# Altium project vme6U_carrier_Cyc_V_SoC.PrjPcb (part 1 of 8)
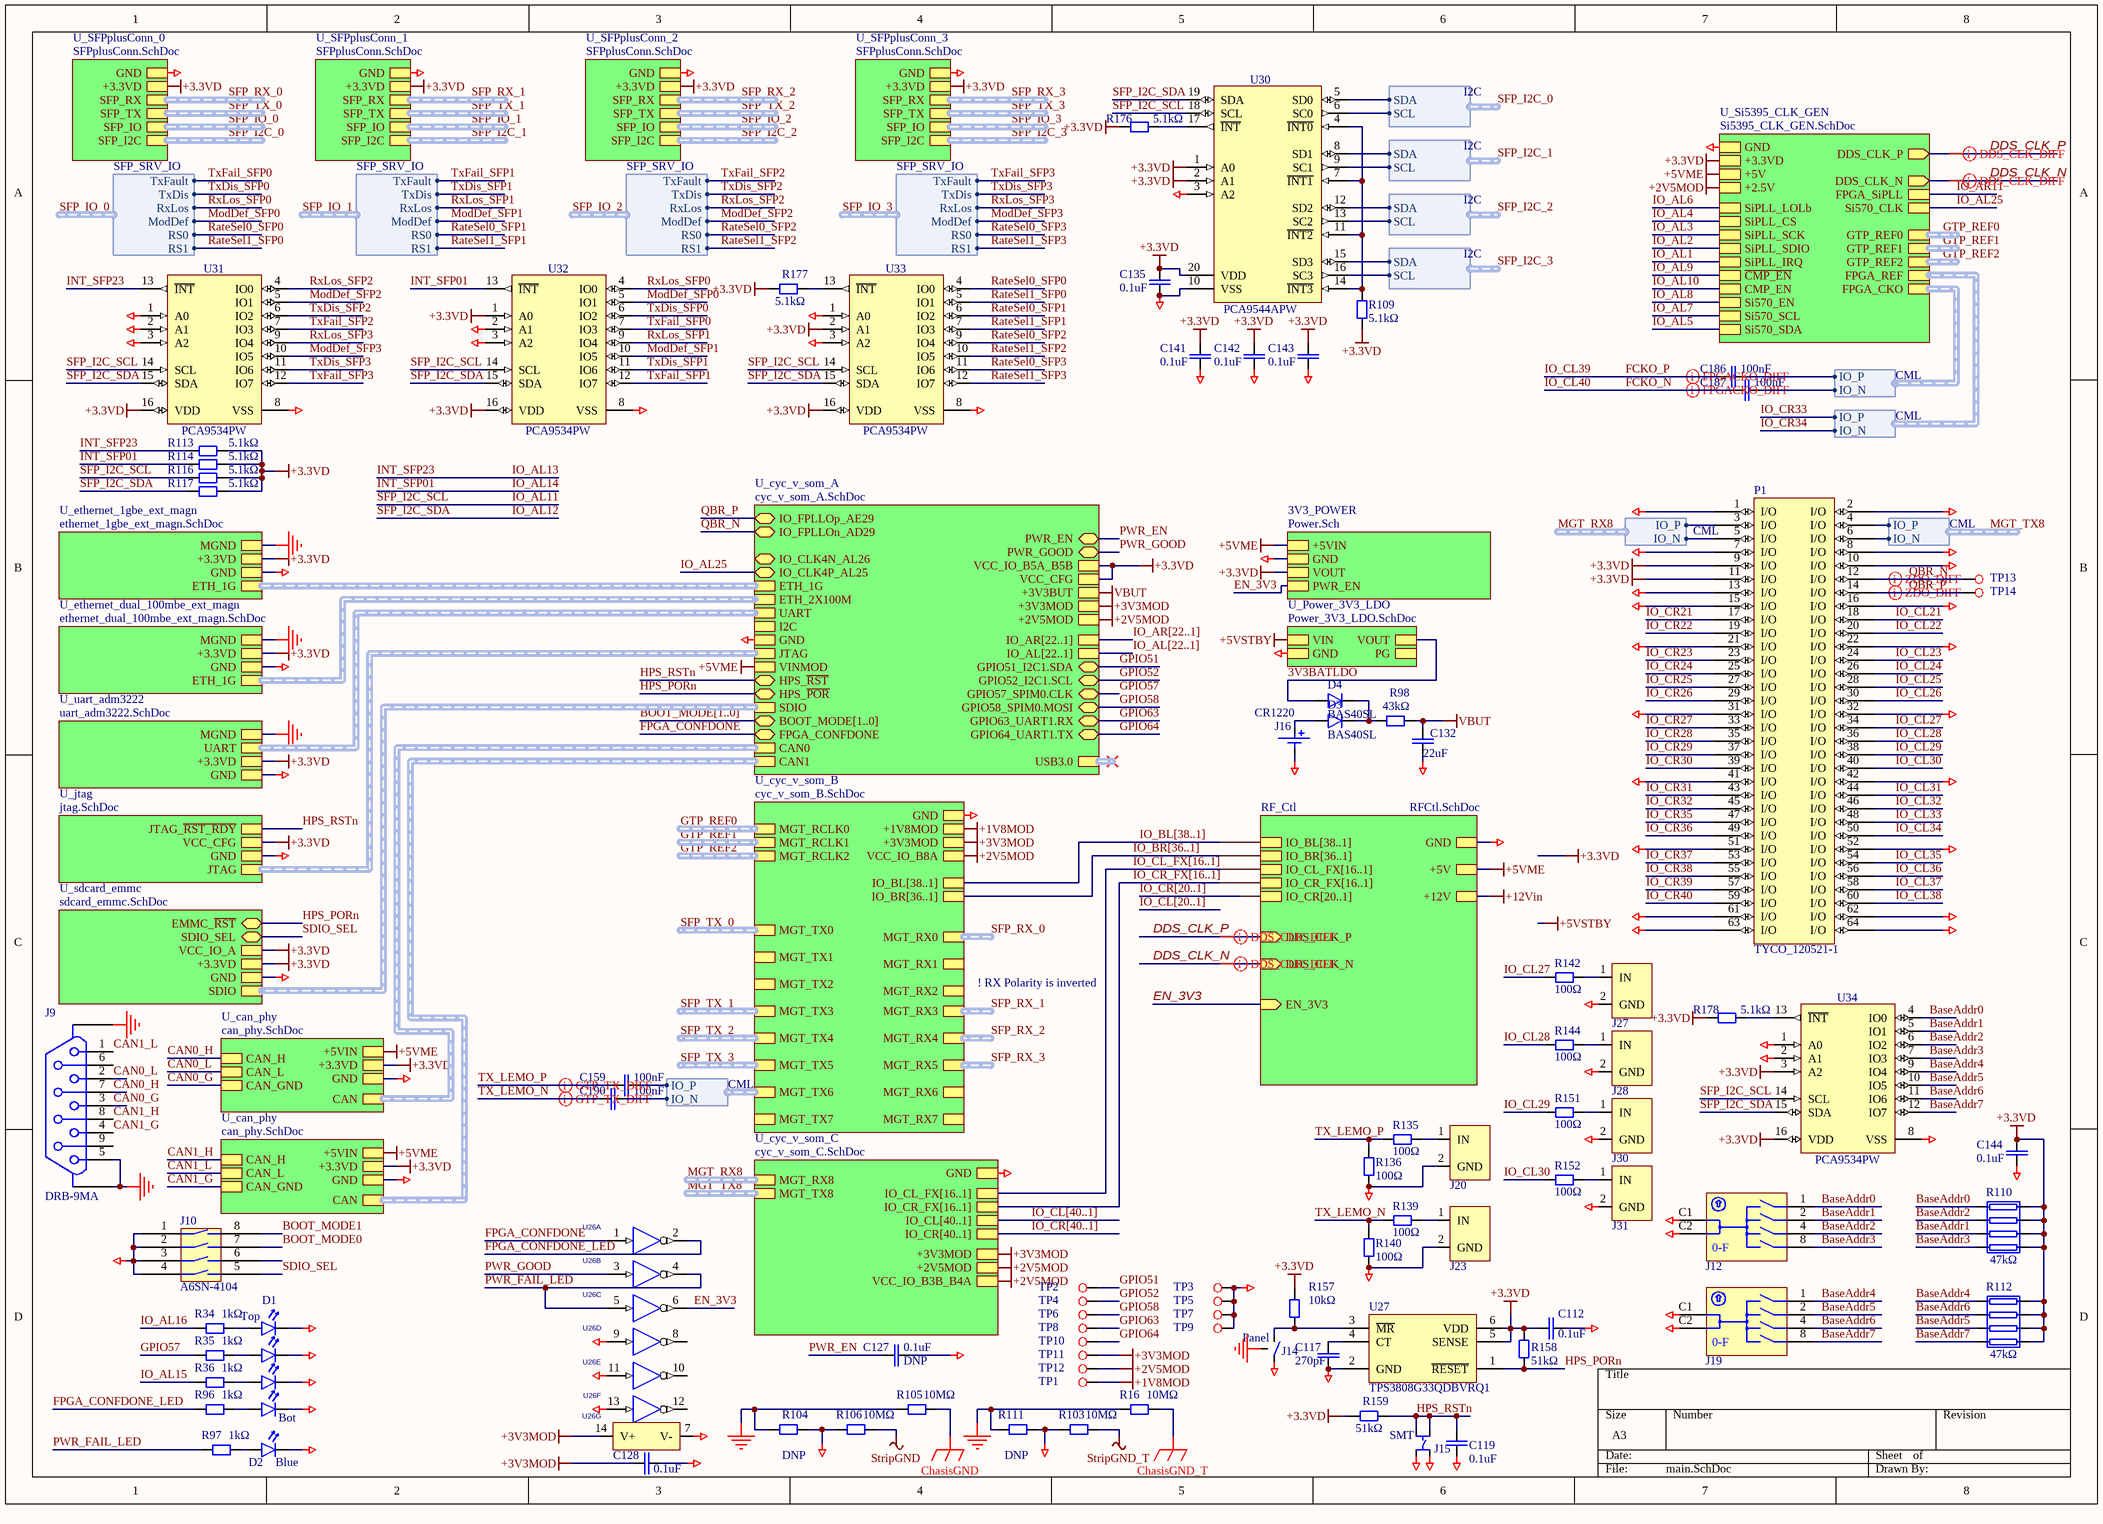
[diagram p0: main.SchDoc]
28 sheets, 1310 parts. Net scope: strictly hierarchical (ports join the sheet entries above them; power ports are local).
Board file: SupBigBrrg_0.PcbDoc
Sheets:
  main.SchDoc
    U_cyc_v_som_A = cyc_v_som_A.SchDoc
    U_cyc_v_som_B = cyc_v_som_B.SchDoc
    U_cyc_v_som_C = cyc_v_som_C.SchDoc
    U_ethernet_1gbe_ext_magn = ethernet_1gbe_ext_magn.SchDoc
    U_ethernet_dual_100mbe_ext_magn = ethernet_dual_100mbe_ext_magn.SchDoc
    U_uart_adm3222 = uart_adm3222.SchDoc
    U_jtag = jtag.SchDoc
    U_sdcard_emmc = sdcard_emmc.SchDoc
    U_can_phy = can_phy.SchDoc
    U_can_phy = can_phy.SchDoc
    U_Power_3V3_LDO = Power_3V3_LDO.SchDoc
    U_SFPplusConn_0 = SFPplusConn.SchDoc
    U_SFPplusConn_1 = SFPplusConn.SchDoc
    U_SFPplusConn_2 = SFPplusConn.SchDoc
    U_SFPplusConn_3 = SFPplusConn.SchDoc
    U_Si5395_CLK_GEN = Si5395_CLK_GEN.SchDoc
      U_power_REG104GA_1V8 = power_REG104GA_1V8.SchDoc
      U_power_REG104GA_3V3 = power_REG104GA_3V3.SchDoc
    RF_Ctl = RFCtl.SchDoc
      RF_H = Hall.SchDoc
        H_DCDC = DCDC_Hall.SchDoc
          DCP_H- = DCP.SchDoc
      RF_i = Integrator.SchDoc
        i_DCDC = DCDC_int.SchDoc
          DCP_i- = DCP.SchDoc
          DCP_i+ = DCP.SchDoc
      RF_D = DDS.SchDoc
        D_DCDC = DCDC_DDS.SchDoc
          DCP_D+ = DCP.SchDoc
          DCP_D- = DCP.SchDoc
      RF_S = SlowChans.SchDoc
        S_DCDC = DCDC_Slow.SchDoc
          DCP_S+ = DCP.SchDoc
          DCP_S- = DCP.SchDoc
  DiagrammaStrutturale.SchDoc
  PowerSys.DiagrammaStrutturaleH.SchDoc
  Buffers.DiagrammaStrutturale.SchDoc

## Sheet main.SchDoc
size A3

### Parts
(Parts that share a designator on the sheet are numbered #1, #2 ... from top to bottom, then left to right.)
C112#1  0.1uF  [CAPC2012N]
C117#1  270pF  [CAPC2012N]
C119  0.1uF  [CAPC2012N]
C127#1  PartField: 0.1uF  [CAPC2012N]  (hidden comment: DNP)
C128  0.1uF  [CAPC2012N]
C132  22uF  [CAPC2012N]
C135  0.1uF  [CAPC2012N]
C141  0.1uF  [CAPC2012N]
C142#1  0.1uF  [CAPC2012N]
C143#1  0.1uF  [CAPC2012N]
C144  0.1uF  [CAPC2012N]
C159#1  100nF  [CAPC1608N]
C186  100nF  [CAPC1608N]
C187  100nF  [CAPC1608N]
C190  100nF  [CAPC1608N]
D1  H485CGDL  [LED_H485C]  (value not drawn)
D2  Color: Blue  [LEDC1608N]  (hidden comment: LB Q39E-N1OO-35-1)
D3  BAS40SL  [SOD_923]
D4  BAS40SL  [SOD_923]
J9  DRB-9MA  [DRB-9MA]
J10  A6SN-4104  [DIPSW4-A6SN8]
J12  ERD116XSZ  [SW_ECE_ERD116XSZ]  (value not drawn)
J14  PTS645VL582LFS  [PTS645VL582LFS]  (value not drawn)
J15  PTS645SL43SMTR92  [PTS645SL43SMTR92]  (value not drawn)
J16  BC501SM  [BAT_CR1220]  (value not drawn)
J19  ERD116XSZ  [SW_ECE_ERD116XSZ]  (value not drawn)
J20  DNP  [LEMO_EPA.00.250.NTN]  (value not drawn)
J23  DNP  [LEMO_EPA.00.250.NTN]  (value not drawn)
J27  DNP  [LEMO_EPA.00.250.NTN]  (value not drawn)
J28  DNP  [LEMO_EPA.00.250.NTN]  (value not drawn)
J30  DNP  [LEMO_EPA.00.250.NTN]  (value not drawn)
J31  DNP  [LEMO_EPA.00.250.NTN]  (value not drawn)
P1  TYCO_120521-1  [TYCO_120521-1]
R16  10MΩ  [RESC2012N]
R34  1kΩ  [RESC2012N]
R35  1kΩ  [RESC2012N]
R36  1kΩ  [RESC2012N]
R96  1kΩ  [RESC2012N]
R97#1  1kΩ  [RESC2012N]
R98#1  43kΩ  [RESC2012N]
R103#1  10MΩ  [RESC2012N]
R104#1  DNP  [RESC2012N]
R105  10MΩ  [RESC2012N]
R106#1  10MΩ  [RESC2012N]
R109  5.1kΩ  [RESC2012N]
R110#1  value 47kΩ  [CAY16-J4]  (hidden comment: CAY16-4702F4LF)
R111#1  DNP  [RESC2012N]
R112  value 47kΩ  [CAY16-J4]  (hidden comment: CAY16-4702F4LF)
R113#1  5.1kΩ  [RESC2012N]
R114#1  5.1kΩ  [RESC2012N]
R116  5.1kΩ  [RESC2012N]
R117#1  5.1kΩ  [RESC2012N]
R135#1  100Ω  [RESC1608N]
R136  100Ω  [RESC1608N]
R139  100Ω  [RESC1608N]
R140  100Ω  [RESC1608N]
R142  100Ω  [RESC1608N]
R144  100Ω  [RESC1608N]
R151  100Ω  [RESC1608N]
R152  100Ω  [RESC1608N]
R157  10kΩ  [RESC2012N]
R158  51kΩ  [RESC2012N]
R159  51kΩ  [RESC2012N]
R176  5.1kΩ  [RESC2012N]
R177  5.1kΩ  [RESC2012N]
R178  5.1kΩ  [RESC2012N]
TP1  test point  [TEST_POINT]  (value not drawn)  (no BOM)
TP2  test point  [TEST_POINT]  (value not drawn)  (no BOM)
TP3  test point  [TEST_POINT]  (value not drawn)  (no BOM)
TP4  test point  [TEST_POINT]  (value not drawn)  (no BOM)
TP5  test point  [TEST_POINT]  (value not drawn)  (no BOM)
TP6  test point  [TEST_POINT]  (value not drawn)  (no BOM)
TP7  test point  [TEST_POINT]  (value not drawn)  (no BOM)
TP8  test point  [TEST_POINT]  (value not drawn)  (no BOM)
TP9  test point  [TEST_POINT]  (value not drawn)  (no BOM)
TP10  test point  [TEST_POINT]  (value not drawn)  (no BOM)
TP11  test point  [TEST_POINT]  (value not drawn)  (no BOM)
TP12  test point  [TEST_POINT]  (value not drawn)  (no BOM)
TP13  test point  [TEST_POINT]  (value not drawn)  (no BOM)
TP14  test point  [TEST_POINT]  (value not drawn)  (no BOM)
U26#1  SN74LVC04APW  [SOP65P640X110-14N]  (value not drawn)  (parts A,B,C,D,E,F,G of 7)
U27  TPS3808G33QDBVRQ1  [SOT95P280X100-6N]
U30#1  PCA9544APW  [SOP65P640X110-20N]
U31#1  PCA9534PW  [SOP65P640X110-16N]
U32  PCA9534PW  [SOP65P640X110-16N]
U33  PCA9534PW  [SOP65P640X110-16N]
U34  PCA9534PW  [SOP65P640X110-16N]

### Sub-sheets
3V3_POWER = Power.Sch (file not in this document): +5VIN, GND, VOUT, PWR_EN
RF_Ctl = RFCtl.SchDoc: IO_CR[20..1], IO_BL[38..1], IO_BR[36..1], IO_CL_FX[16..1], IO_CR_FX[16..1], DDS_CLK_P (in), DDS_CLK_N (in), EN_3V3 (in), GND, +5V, +12V
U_can_phy = can_phy.SchDoc: CAN (harness CAN), GND, +3.3VD, CAN_H, CAN_L, CAN_GND, +5VIN
U_can_phy = can_phy.SchDoc: CAN (harness CAN), GND, +3.3VD, CAN_H, CAN_L, CAN_GND, +5VIN
U_cyc_v_som_A = cyc_v_som_A.SchDoc: ETH_1G (harness EthLanes), ETH_2X100M (harness EthLanes), UART (harness UART), I2C (harness I2C), GND, JTAG (harness JTAG), VINMOD, HPS_~{RST} (bidir), HPS_~{POR} (bidir), SDIO (harness SDIO), BOOT_MODE[1..0] (bidir), FPGA_CONFDONE (bidir), CAN0 (harness CAN), CAN1 (harness CAN), IO_AR[22..1], +2V5MOD, +3V3MOD, GPIO52_I2C1.SCL (bidir), GPIO63_UART1.RX (bidir), GPIO51_I2C1.SDA (bidir), GPIO57_SPIM0.CLK (bidir), GPIO64_UART1.TX (bidir), USB3.0 (harness USB3), GPIO58_SPIM0.MOSI (bidir), +3V3BUT, IO_CLK4N_AL26 (bidir), IO_CLK4P_AL25 (bidir), PWR_EN (bidir), PWR_GOOD (bidir), VCC_IO_B5A_B5B, VCC_CFG, IO_FPLLOp_AE29 (bidir), IO_AL[22..1], IO_FPLLOn_AD29 (bidir)
U_cyc_v_som_B = cyc_v_som_B.SchDoc: GND, MGT_RCLK2 (harness CML), MGT_RCLK1 (harness CML), IO_BL[38..1], IO_BR[36..1], MGT_RCLK0 (harness CML), +1V8MOD, +3V3MOD, VCC_IO_B8A, MGT_TX5 (harness CML), MGT_TX3 (harness CML), MGT_TX6 (harness CML), MGT_TX7 (harness CML), MGT_TX2 (harness CML), MGT_TX1 (harness CML), MGT_TX4 (harness CML), MGT_TX0 (harness CML), MGT_RX0 (harness CML), MGT_RX1 (harness CML), MGT_RX6 (harness CML), MGT_RX4 (harness CML), MGT_RX5 (harness CML), MGT_RX3 (harness CML), MGT_RX2 (harness CML), MGT_RX7 (harness CML)
U_cyc_v_som_C = cyc_v_som_C.SchDoc: GND, MGT_TX8 (harness CML), IO_CL_FX[16..1], IO_CR_FX[16..1], MGT_RX8 (harness CML), IO_CL[40..1], IO_CR[40..1], +3V3MOD, +2V5MOD, VCC_IO_B3B_B4A
U_ethernet_1gbe_ext_magn = ethernet_1gbe_ext_magn.SchDoc: ETH_1G (harness EthLanes), GND, +3.3VD, MGND
U_ethernet_dual_100mbe_ext_magn = ethernet_dual_100mbe_ext_magn.SchDoc: ETH_1G (harness EthLanes), GND, +3.3VD, MGND
U_jtag = jtag.SchDoc: JTAG (harness JTAG), GND, VCC_CFG, JTAG_~{RST_RDY}
U_Power_3V3_LDO = Power_3V3_LDO.SchDoc: GND, VOUT, VIN, PG
U_sdcard_emmc = sdcard_emmc.SchDoc: SDIO (harness SDIO), GND, +3.3VD, VCC_IO_A, SDIO_SEL (bidir), EMMC_~{RST} (bidir)
U_SFPplusConn_0 = SFPplusConn.SchDoc: GND, +3.3VD, SFP_TX (harness CML), SFP_RX (harness CML), SFP_IO (harness SFP_SRV_IO), SFP_I2C (harness I2C)
U_SFPplusConn_1 = SFPplusConn.SchDoc: GND, +3.3VD, SFP_TX (harness CML), SFP_RX (harness CML), SFP_IO (harness SFP_SRV_IO), SFP_I2C (harness I2C)
U_SFPplusConn_2 = SFPplusConn.SchDoc: GND, +3.3VD, SFP_TX (harness CML), SFP_RX (harness CML), SFP_IO (harness SFP_SRV_IO), SFP_I2C (harness I2C)
U_SFPplusConn_3 = SFPplusConn.SchDoc: GND, +3.3VD, SFP_TX (harness CML), SFP_RX (harness CML), SFP_IO (harness SFP_SRV_IO), SFP_I2C (harness I2C)
U_Si5395_CLK_GEN = Si5395_CLK_GEN.SchDoc: GND, +3.3VD, +5V, Si570_CLK, Si570_SCL, Si570_SDA, Si570_EN, ~{CMP_EN}, CMP_EN, +2.5V, FPGA_SiPLL, GTP_REF1 (harness CML), GTP_REF0 (harness CML), GTP_REF2 (harness CML), FPGA_CKO (harness CML), SiPLL_IRQ, SiPLL_SDIO, SiPLL_SCK, SiPLL_CS, FPGA_REF (harness CML), SiPLL_LOLb, DDS_CLK_P (out), DDS_CLK_N (out)
U_uart_adm3222 = uart_adm3222.SchDoc: GND, +3.3VD, UART (harness UART), MGND

### Harnesses
I2C: SDA, SCL
SFP_SRV_IO: TxDis, TxFault, RS0, RS1, ModDef, RxLos
CML: IO_N, IO_P

### Nets
+1V8MOD: TP1.1 ; sheet U_cyc_v_som_B/+1V8MOD
+2V5MOD: TP12.1 ; sheet U_cyc_v_som_A/+2V5MOD, sheet U_cyc_v_som_B/VCC_IO_B8A, sheet U_cyc_v_som_C/+2V5MOD, sheet U_cyc_v_som_C/VCC_IO_B3B_B4A, sheet U_Si5395_CLK_GEN/+2.5V
+3.3VD: C112#1.2 C135.1 C141.1 C142#1.1 C143#1.1 C144.1 P1.9(I/O) P1.11(I/O) R109.2 R110#1.5 R110#1.6 R110#1.7 R110#1.8 R112.5 R112.6 R112.7 R112.8 R113#1.2 R114#1.2 R116.2 R117#1.2 R157.1 R158.1 R159.1 R176.1 R177.1 R178.1 U27.5(SENSE) U27.6(VDD) U30#1.1(A0) U30#1.2(A1) U30#1.20(VDD) U31#1.16(VDD) U32.1(A0) U32.16(VDD) U33.2(A1) U33.16(VDD) U34.3(A2) U34.16(VDD) ; sheet U_cyc_v_som_A/VCC_IO_B5A_B5B, sheet U_cyc_v_som_A/VCC_CFG, sheet U_ethernet_1gbe_ext_magn/+3.3VD, sheet U_ethernet_dual_100mbe_ext_magn/+3.3VD, sheet U_uart_adm3222/+3.3VD, sheet U_jtag/VCC_CFG, sheet U_sdcard_emmc/+3.3VD, sheet U_sdcard_emmc/VCC_IO_A, sheet 3V3_POWER/VOUT, sheet U_can_phy/+3.3VD, sheet U_can_phy/+3.3VD, sheet U_SFPplusConn_0/+3.3VD, sheet U_SFPplusConn_1/+3.3VD, sheet U_SFPplusConn_2/+3.3VD, sheet U_SFPplusConn_3/+3.3VD, sheet U_Si5395_CLK_GEN/+3.3VD
+3V3MOD: C128.2 TP11.1 U26#1.14(V+) ; sheet U_cyc_v_som_A/+3V3MOD, sheet U_cyc_v_som_B/+3V3MOD, sheet U_cyc_v_som_C/+3V3MOD
+5VME: sheet U_cyc_v_som_A/VINMOD, sheet 3V3_POWER/+5VIN, sheet U_can_phy/+5VIN, sheet U_can_phy/+5VIN, sheet U_Si5395_CLK_GEN/+5V, sheet RF_Ctl/+5V
ChasisGND: R105.2
ChasisGND_T: R16.2
GND: C112#1.1 C117#1.2 C119.2 C127#1.1 C128.1 C132.1 C135.2 C141.2 C142#1.2 C143#1.2 C144.2 D1.2(C) D1.4(C) D1.6(C) D1.8(C) D2.1(C) J10.1 J10.2 J10.3 J10.4 J12.C1(C) J12.C2(C) J14.2 J15.3 J15.4 J16.2(-) J19.C1(C) J19.C2(C) J20.2(GND) J23.2(GND) J27.2(GND) J28.2(GND) J30.2(GND) J31.2(GND) P1.1(I/O) P1.2(I/O) P1.7(I/O) P1.8(I/O) P1.10(I/O) P1.13(I/O) P1.15(I/O) P1.16(I/O) P1.21(I/O) P1.22(I/O) P1.31(I/O) P1.32(I/O) P1.41(I/O) P1.42(I/O) P1.51(I/O) P1.52(I/O) P1.61(I/O) P1.62(I/O) P1.63(I/O) P1.64(I/O) R103#1.1 R104#1.2 R106#1.1 R111#1.2 R136.2 R140.2 TP3.1 TP5.1 TP7.1 TP9.1 U26#1.7(V-) U26#1.9(A) U26#1.11(A) U26#1.13(A) U27.2(GND) U30#1.3(A2) U30#1.10(VSS) U31#1.1(A0) U31#1.2(A1) U31#1.3(A2) U31#1.8(VSS) U32.2(A1) U32.3(A2) U32.8(VSS) U33.1(A0) U33.3(A2) U33.8(VSS) U34.1(A0) U34.2(A1) U34.8(VSS) ; sheet U_cyc_v_som_A/GND, sheet U_cyc_v_som_B/GND, sheet U_cyc_v_som_C/GND, sheet U_ethernet_1gbe_ext_magn/GND, sheet U_ethernet_dual_100mbe_ext_magn/GND, sheet U_uart_adm3222/GND, sheet U_jtag/GND, sheet U_sdcard_emmc/GND, sheet 3V3_POWER/GND, sheet U_can_phy/GND, sheet U_can_phy/GND, sheet U_Power_3V3_LDO/GND, sheet U_SFPplusConn_0/GND, sheet U_SFPplusConn_1/GND, sheet U_SFPplusConn_2/GND, sheet U_SFPplusConn_3/GND, sheet U_Si5395_CLK_GEN/GND, sheet RF_Ctl/GND  [project net POK_int]
MGND: J9.5 J9.S1(SHLD) J9.S2(SHLD) J14.0(S) R16.1 R104#1.1 R105.1 R111#1.1 ; sheet U_ethernet_1gbe_ext_magn/MGND, sheet U_ethernet_dual_100mbe_ext_magn/MGND, sheet U_uart_adm3222/MGND
StripGND: R106#1.2
StripGND_T: R103#1.2
VBUT: C132.2 R98#1.1 ; sheet U_cyc_v_som_A/+3V3BUT
3V3BATLDO: D4.1(A) ; sheet U_Power_3V3_LDO/VOUT
BaseAddr0: J12.1 R110#1.4 U34.4(IO0)
BaseAddr1: J12.2 R110#1.2 U34.5(IO1)
BaseAddr2: J12.4 R110#1.3 U34.6(IO2)
BaseAddr3: J12.8 R110#1.1 U34.7(IO3)
BaseAddr4: J19.1 R112.4 U34.9(IO4)
BaseAddr5: J19.2 R112.2 U34.10(IO5)
BaseAddr6: J19.4 R112.3 U34.11(IO6)
BaseAddr7: J19.8 R112.1 U34.12(IO7)
BOOT_MODE0: J10.7
BOOT_MODE1: J10.8
CAN0_G: J9.3 ; sheet U_can_phy/CAN_GND
CAN0_H: J9.7 ; sheet U_can_phy/CAN_H
CAN0_L: J9.2 ; sheet U_can_phy/CAN_L
CAN1_G: J9.4 ; sheet U_can_phy/CAN_GND
CAN1_H: J9.8 ; sheet U_can_phy/CAN_H
CAN1_L: J9.1 ; sheet U_can_phy/CAN_L
DDS_CLK_N: sheet U_Si5395_CLK_GEN/DDS_CLK_N, sheet RF_Ctl/DDS_CLK_N
DDS_CLK_P: sheet U_Si5395_CLK_GEN/DDS_CLK_P, sheet RF_Ctl/DDS_CLK_P
EN_3V3: U26#1.6(B) ; sheet 3V3_POWER/PWR_EN, sheet RF_Ctl/EN_3V3
FCKO_N: C187.1  [also labelled IO_CL40]
FCKO_P: C186.1  [also labelled IO_CL39]
FPGA_CONFDONE: U26#1.1(A) ; sheet U_cyc_v_som_A/FPGA_CONFDONE
FPGA_CONFDONE_LED: R96.1 U26#1.2(B)
GPIO51: TP2.1 ; sheet U_cyc_v_som_A/GPIO51_I2C1.SDA
GPIO52: TP4.1 ; sheet U_cyc_v_som_A/GPIO52_I2C1.SCL
GPIO57: R35.1 ; sheet U_cyc_v_som_A/GPIO57_SPIM0.CLK
GPIO58: TP6.1 ; sheet U_cyc_v_som_A/GPIO58_SPIM0.MOSI
GPIO63: TP8.1 ; sheet U_cyc_v_som_A/GPIO63_UART1.RX
GPIO64: TP10.1 ; sheet U_cyc_v_som_A/GPIO64_UART1.TX
HPS_PORn: R158.2 U27.1(~{RESET}) ; sheet U_cyc_v_som_A/HPS_~{POR}, sheet U_sdcard_emmc/EMMC_~{RST}
HPS_RSTn: C119.1 J15.1 J15.2 R159.2 ; sheet U_cyc_v_som_A/HPS_~{RST}, sheet U_jtag/JTAG_~{RST_RDY}
IN2_N: C187.2 ; sheet U_Si5395_CLK_GEN/FPGA_CKO.IO_N
IN2_P: C186.2 ; sheet U_Si5395_CLK_GEN/FPGA_CKO.IO_P
INT_SFP01: R114#1.1 U32.13(~{INT})  [also labelled IO_AL14]
INT_SFP23: R113#1.1 U31#1.13(~{INT})  [also labelled IO_AL13]
IO_AL11: R116.1 U30#1.18(SCL) U31#1.14(SCL) U32.14(SCL) U33.14(SCL) U34.14(SCL)  [also labelled SFP_I2C_SCL]
IO_AL12: R117#1.1 U30#1.19(SDA) U31#1.15(SDA) U32.15(SDA) U33.15(SDA) U34.15(SDA)  [also labelled SFP_I2C_SDA]
IO_AL15: R36.1
IO_AL16: R34.1
IO_AL25: sheet U_cyc_v_som_A/IO_CLK4P_AL25, sheet U_Si5395_CLK_GEN/Si570_CLK
IO_CL21: P1.18(I/O)
IO_CL22: P1.20(I/O)
IO_CL23: P1.24(I/O)
IO_CL24: P1.26(I/O)
IO_CL25: P1.28(I/O)
IO_CL26: P1.30(I/O)
IO_CL27: P1.34(I/O) R142.2
IO_CL28: P1.36(I/O) R144.2
IO_CL29: P1.38(I/O) R151.2
IO_CL30: P1.40(I/O) R152.2
IO_CL31: P1.44(I/O)
IO_CL32: P1.46(I/O)
IO_CL33: P1.48(I/O)
IO_CL34: P1.50(I/O)
IO_CL35: P1.54(I/O)
IO_CL36: P1.56(I/O)
IO_CL37: P1.58(I/O)
IO_CL38: P1.60(I/O)
IO_CR21: P1.17(I/O)
IO_CR22: P1.19(I/O)
IO_CR23: P1.23(I/O)
IO_CR24: P1.25(I/O)
IO_CR25: P1.27(I/O)
IO_CR26: P1.29(I/O)
IO_CR27: P1.33(I/O)
IO_CR28: P1.35(I/O)
IO_CR29: P1.37(I/O)
IO_CR30: P1.39(I/O)
IO_CR31: P1.43(I/O)
IO_CR32: P1.45(I/O)
IO_CR35: P1.47(I/O)
IO_CR36: P1.49(I/O)
IO_CR37: P1.53(I/O)
IO_CR38: P1.55(I/O)
IO_CR39: P1.57(I/O)
IO_CR40: P1.59(I/O)
MGT_RX8.IO_N: P1.5(I/O) ; sheet U_cyc_v_som_C/MGT_RX8.IO_N
MGT_RX8.IO_P: P1.3(I/O) ; sheet U_cyc_v_som_C/MGT_RX8.IO_P
MGT_TX6_N: C190.2 ; sheet U_cyc_v_som_B/MGT_TX6.IO_N
MGT_TX6_P: C159#1.2 ; sheet U_cyc_v_som_B/MGT_TX6.IO_P
MGT_TX8.IO_N: P1.6(I/O) ; sheet U_cyc_v_som_C/MGT_TX8.IO_N
MGT_TX8.IO_P: P1.4(I/O) ; sheet U_cyc_v_som_C/MGT_TX8.IO_P
ModDef_SFP0: U32.5(IO1) ; sheet U_SFPplusConn_0/SFP_IO.ModDef
ModDef_SFP1: U32.10(IO5) ; sheet U_SFPplusConn_1/SFP_IO.ModDef
ModDef_SFP2: U31#1.5(IO1) ; sheet U_SFPplusConn_2/SFP_IO.ModDef
ModDef_SFP3: U31#1.10(IO5) ; sheet U_SFPplusConn_3/SFP_IO.ModDef
PWR_EN: C127#1.2 ; sheet U_cyc_v_som_A/PWR_EN
PWR_FAIL_LED: R97#1.1 U26#1.4(B) U26#1.5(A)
PWR_GOOD: U26#1.3(A) ; sheet U_cyc_v_som_A/PWR_GOOD
QBR_N: P1.12(I/O) TP13.1 ; sheet U_cyc_v_som_A/IO_FPLLOn_AD29
QBR_P: P1.14(I/O) TP14.1 ; sheet U_cyc_v_som_A/IO_FPLLOp_AE29
RateSel0_SFP0: U33.4(IO0) ; sheet U_SFPplusConn_0/SFP_IO.RS0
RateSel0_SFP1: U33.6(IO2) ; sheet U_SFPplusConn_1/SFP_IO.RS0
RateSel0_SFP2: U33.9(IO4) ; sheet U_SFPplusConn_2/SFP_IO.RS0
RateSel0_SFP3: U33.11(IO6) ; sheet U_SFPplusConn_3/SFP_IO.RS0
RateSel1_SFP0: U33.5(IO1) ; sheet U_SFPplusConn_0/SFP_IO.RS1
RateSel1_SFP1: U33.7(IO3) ; sheet U_SFPplusConn_1/SFP_IO.RS1
RateSel1_SFP2: U33.10(IO5) ; sheet U_SFPplusConn_2/SFP_IO.RS1
RateSel1_SFP3: U33.12(IO7) ; sheet U_SFPplusConn_3/SFP_IO.RS1
RxLos_SFP0: U32.4(IO0) ; sheet U_SFPplusConn_0/SFP_IO.RxLos
RxLos_SFP1: U32.9(IO4) ; sheet U_SFPplusConn_1/SFP_IO.RxLos
RxLos_SFP2: U31#1.4(IO0) ; sheet U_SFPplusConn_2/SFP_IO.RxLos
RxLos_SFP3: U31#1.9(IO4) ; sheet U_SFPplusConn_3/SFP_IO.RxLos
SDIO_SEL: J10.5 ; sheet U_sdcard_emmc/SDIO_SEL
SFP_I2C_0.SCL: U30#1.6(SC0) ; sheet U_SFPplusConn_0/SFP_I2C.SCL
SFP_I2C_0.SDA: U30#1.5(SD0) ; sheet U_SFPplusConn_0/SFP_I2C.SDA
SFP_I2C_1.SCL: U30#1.9(SC1) ; sheet U_SFPplusConn_1/SFP_I2C.SCL
SFP_I2C_1.SDA: U30#1.8(SD1) ; sheet U_SFPplusConn_1/SFP_I2C.SDA
SFP_I2C_2.SCL: U30#1.13(SC2) ; sheet U_SFPplusConn_2/SFP_I2C.SCL
SFP_I2C_2.SDA: U30#1.12(SD2) ; sheet U_SFPplusConn_2/SFP_I2C.SDA
SFP_I2C_3.SCL: U30#1.16(SC3) ; sheet U_SFPplusConn_3/SFP_I2C.SCL
SFP_I2C_3.SDA: U30#1.15(SD3) ; sheet U_SFPplusConn_3/SFP_I2C.SDA
TX_LEMO_N: C190.1 R139.2 R140.1
TX_LEMO_P: C159#1.1 R135#1.2 R136.1
TxDis_SFP0: U32.6(IO2) ; sheet U_SFPplusConn_0/SFP_IO.TxDis  [project net SFP_IO_0.TxDis]
TxDis_SFP1: U32.11(IO6) ; sheet U_SFPplusConn_1/SFP_IO.TxDis  [project net SFP_IO_1.TxDis]
TxDis_SFP2: U31#1.6(IO2) ; sheet U_SFPplusConn_2/SFP_IO.TxDis  [project net SFP_IO_2.TxDis]
TxDis_SFP3: U31#1.11(IO6) ; sheet U_SFPplusConn_3/SFP_IO.TxDis  [project net SFP_IO_3.TxDis]
TxFail_SFP0: U32.7(IO3) ; sheet U_SFPplusConn_0/SFP_IO.TxFault  [project net SFP_IO_0.TxFault]
TxFail_SFP1: U32.12(IO7) ; sheet U_SFPplusConn_1/SFP_IO.TxFault  [project net SFP_IO_1.TxFault]
TxFail_SFP2: U31#1.7(IO3) ; sheet U_SFPplusConn_2/SFP_IO.TxFault  [project net SFP_IO_2.TxFault]
TxFail_SFP3: U31#1.12(IO7) ; sheet U_SFPplusConn_3/SFP_IO.TxFault  [project net SFP_IO_3.TxFault]
NetC117#1_1: C117#1.1 U27.4(CT)
NetD1_1: D1.1(A) R96.2
NetD1_3: D1.3(A) R36.2
NetD1_5: D1.5(A) R35.2
NetD1_7: D1.7(A) R34.2
NetD2_2: D2.2(A) R97#1.2
NetD3_1: D3.1(A) J16.1(+)
NetD3_2: D3.2(C) D4.2(C) R98#1.2
NetJ14_1: J14.1 R157.2 U27.3(~{MR})
NetJ20_1: J20.1(IN) R135#1.1
NetJ23_1: J23.1(IN) R139.1
NetJ27_1: J27.1(IN) R142.1
NetJ28_1: J28.1(IN) R144.1
NetJ30_1: J30.1(IN) R151.1
NetJ31_1: J31.1(IN) R152.1
NetR109_1: R109.1 U30#1.4(~{INT0}) U30#1.7(~{INT1}) U30#1.11(~{INT2}) U30#1.14(~{INT3})
NetR176_2: R176.2 U30#1.17(~{INT})
NetR177_2: R177.2 U33.13(~{INT})
NetR178_2: R178.2 U34.13(~{INT})

Not connected (* = marked no-connect by the designer): J9 6 9; J10 6; U26#1 8(B) 10(B) 12(B)

### Buses and harness runs
bus BOOT_MODE[1..0] = sheet U_cyc_v_som_A/BOOT_MODE[1..0]
bus IO_AL[22..1] = sheet U_cyc_v_som_A/IO_AL[22..1]
bus IO_AR[22..1] = sheet U_cyc_v_som_A/IO_AR[22..1]
bus IO_BL[38..1] = sheet RF_Ctl/IO_BL[38..1] = sheet U_cyc_v_som_B/IO_BL[38..1]
bus IO_BR[36..1] = sheet RF_Ctl/IO_BR[36..1] = sheet U_cyc_v_som_B/IO_BR[36..1]
bus IO_CL[20..1]
bus IO_CL[40..1] = sheet U_cyc_v_som_C/IO_CL[40..1]
bus IO_CL_FX[16..1] = sheet RF_Ctl/IO_CL_FX[16..1] = sheet U_cyc_v_som_C/IO_CL_FX[16..1]
bus IO_CR[20..1] = sheet RF_Ctl/IO_CR[20..1]
bus IO_CR[40..1] = sheet U_cyc_v_som_C/IO_CR[40..1]
bus IO_CR_FX[16..1] = sheet RF_Ctl/IO_CR_FX[16..1] = sheet U_cyc_v_som_C/IO_CR_FX[16..1]
harness GTP_REF0 = sheet U_cyc_v_som_B/MGT_RCLK0
harness GTP_REF0 = sheet U_Si5395_CLK_GEN/GTP_REF0
harness GTP_REF1 = sheet U_cyc_v_som_B/MGT_RCLK1
harness GTP_REF1 = sheet U_Si5395_CLK_GEN/GTP_REF1
harness GTP_REF2 = sheet U_cyc_v_som_B/MGT_RCLK2
harness GTP_REF2 = sheet U_Si5395_CLK_GEN/GTP_REF2
harness MGT_RX8 = sheet U_cyc_v_som_C/MGT_RX8
harness MGT_TX8 = sheet U_cyc_v_som_C/MGT_TX8
harness SFP_I2C_0 = sheet U_SFPplusConn_0/SFP_I2C
harness SFP_I2C_1 = sheet U_SFPplusConn_1/SFP_I2C
harness SFP_I2C_2 = sheet U_SFPplusConn_2/SFP_I2C
harness SFP_I2C_3 = sheet U_SFPplusConn_3/SFP_I2C
harness SFP_IO_0 = sheet U_SFPplusConn_0/SFP_IO
harness SFP_IO_1 = sheet U_SFPplusConn_1/SFP_IO
harness SFP_IO_2 = sheet U_SFPplusConn_2/SFP_IO
harness SFP_IO_3 = sheet U_SFPplusConn_3/SFP_IO
harness SFP_RX_0 = sheet U_cyc_v_som_B/MGT_RX0
harness SFP_RX_0 = sheet U_SFPplusConn_0/SFP_RX
harness SFP_RX_1 = sheet U_cyc_v_som_B/MGT_RX3
harness SFP_RX_1 = sheet U_SFPplusConn_1/SFP_RX
harness SFP_RX_2 = sheet U_cyc_v_som_B/MGT_RX4
harness SFP_RX_2 = sheet U_SFPplusConn_2/SFP_RX
harness SFP_RX_3 = sheet U_cyc_v_som_B/MGT_RX5
harness SFP_RX_3 = sheet U_SFPplusConn_3/SFP_RX
harness SFP_TX_0 = sheet U_cyc_v_som_B/MGT_TX0
harness SFP_TX_0 = sheet U_SFPplusConn_0/SFP_TX
harness SFP_TX_1 = sheet U_cyc_v_som_B/MGT_TX3
harness SFP_TX_1 = sheet U_SFPplusConn_1/SFP_TX
harness SFP_TX_2 = sheet U_cyc_v_som_B/MGT_TX4
harness SFP_TX_2 = sheet U_SFPplusConn_2/SFP_TX
harness SFP_TX_3 = sheet U_cyc_v_som_B/MGT_TX5
harness SFP_TX_3 = sheet U_SFPplusConn_3/SFP_TX
harness sheet U_can_phy/CAN = sheet U_cyc_v_som_A/CAN0
harness sheet U_can_phy/CAN = sheet U_cyc_v_som_A/CAN1
harness sheet U_cyc_v_som_A/ETH_1G = sheet U_ethernet_1gbe_ext_magn/ETH_1G
harness sheet U_cyc_v_som_A/ETH_2X100M = sheet U_ethernet_dual_100mbe_ext_magn/ETH_1G
harness sheet U_cyc_v_som_A/JTAG = sheet U_jtag/JTAG
harness sheet U_cyc_v_som_A/SDIO = sheet U_sdcard_emmc/SDIO
harness sheet U_cyc_v_som_A/UART = sheet U_uart_adm3222/UART

### Layout directives
differential pair; rule Differential Pairs Routing [Pref Gap = 0.175mm    Min Gap  = 0.075mm    Max Gap  = 0.5mmPref Width = 0.25mm    Min Width  = 0.075mm    Max Width  = 0.5mm]: DDS_CLK_N, DDS_CLK_P, FCKO_N, FCKO_P, TX_LEMO_N, TX_LEMO_P
differential pair; rule Differential Pairs Routing [Pref Gap = 0.175mm    Min Gap  = 0.075mm    Max Gap  = 0.5mmPref Width = 0.15mm    Min Width  = 0.075mm    Max Width  = 0.5mm]: QBR_N, QBR_P

### Notes on the sheet
- (near J16) CR1220
- ! RX Polarity is inverted
- (in symbol ERD116XSZ) 0-F
- (in symbol LEDx4_H485CGDL) Top; Bot
- (in symbol PTS645SL43SMTR92) SMT
- (in symbol PTS645VL582LFS) Panel

### Library data of the parts
C112#1 C117#1 C119 C127#1 C128 C132 C135 C141 C142#1 C143#1 C144 = CAPC: Generic ceramic SMD capacitor; Pkg: 0805; Maintainer: Evgeniy Kotov; SMD Solders: 2; THD Solders: 0; Last Change Data: 06.03.2017; Release Date: 06.03.2017
  C112#1 C119 C128 C135 C141 C142#1 C143#1 C144: PartField: 0.1uF; Value: 0.1uF
  C117#1: PartField: 270pF; Value: 270pF
  C127#1: Value: DNP
  C132: PartField: 22uF; Value: 22uF
C159#1 C186 C187 C190 = CAPC: Generic ceramic SMD capacitor; Pkg: 0603; Maintainer: Evgeniy Kotov; SMD Solders: 2; THD Solders: 0; PartField: 100nF; Last Change Data: 06.03.2017; Release Date: 06.03.2017; Value: 100nF
D1 = LEDx4_H485CGDL: LED Circuit Board Indicator 4 High Green (x 4) Diffused 2.1V Round with Domed Top, 1.80mm Through Hole; Pkg: 8 pin THD Led; Vendor: Bivar Inc.; Maintainer: Evgeniy Kotov; SMD Solders: 0; THD Solders: 8; Forward Current: 5mA; PartField: H485CGDL; Release Date: 28.03.2017; Last Change Data: 28.03.2017; Temperature Range: -55°C to +150°C; Value: H485CGDL; Color: Green
D2 = LED_SMD0603: SMD Led, 0603; Pkg: 0603; Vendor: Vishay; Maintainer: Evgeniy Kotov; SMD Solders: 2; THD Solders: 0; Forward Current: 5mA; PartField: LB Q39E-N1OO-35-1; Release Date: 28.03.2017; Last Change Data: 28.03.2017; Temperature Range: -55°C to +150°C; Value: LB Q39E-N1OO-35-1
D3 D4 = BAS40SL: Schottky Barrier Diode; Pkg: SOD-923F; Vendor: Vishay; Maintainer: Evgeniy Kotov; SMD Solders: 2; THD Solders: 0; Forward Current: 100mA; Reverse Voltage: 40V; Forward Voltage: 0.38V @ 1mA / 1V @ 40mA; Reverse Current: 15mA; PartField: BAS40SL; Release Date: 28.03.2017; Last Change Data: 28.03.2017; Temperature Range: -55°C to +150°C; Value: BAS40SL
J9 = DRB-9MA: D-SUB; 9-pin, male, flange 7.2mm; SolderOption: 0; THD Solders: 11; PartField: DRB-9MA; Value: DRB-9MA; Pkg: DRB-9MA; SMD Solders: 0
J10 = DIPSW4: SMD DIP Switch, Omron A6H or A6SN series; SMD Solders: 8; THD Solders: 0; Pkg: SMD 8pin; Value: A6SN-4104; Manufacturer: Omron; PartField: A6SN-4104
J12 J19 = ERD116XSZ: Vendor: ECE; SolderOption: 0; Pkg: Rotary 6pin; THD Solders: 6; Value: ERD116XSZ; PartField: ERD116XSZ; SMD Solders: 0
J14 = PTS645VL582LFS: Tactile Switch SPST-NO Side Actuated Through Hole, Right Angle; SMD Solders: 0; THD Solders: 4; Maintainer: Evgeniy Kotov; Pkg: Button 4 pin; PartField: PTS645VL582LFS; Last Change Data: 02.04.2017; Release Date: 02.04.2017; Value: PTS645VL582LFS; ComponentLink1Description: Datasheet
J15 = PTS645SL43SMTR92: Tactile Switch SPST-NO Top Actuated Surface Mount; SMD Solders: 4; THD Solders: 0; Maintainer: Evgeniy Kotov; Pkg: Button 4 pin; PartField: PTS645SL43SMTR92; Last Change Data: 02.04.2017; Release Date: 02.04.2017; Value: PTS645SL43SMTR92; ComponentLink1Description: Datasheet
J16 = BAT_CR1220: BATTERY HOLDER COIN 12.5MM SMD; SMD Solders: 2; THD Solders: 0; Maintainer: Evgeniy Kotov; Pkg: 12MM SMD; PartField: BC501SM; Last Change Data: 02.04.2017; Release Date: 02.04.2017; Value: BC501SM; ComponentLink1Description: Datasheet
J20 J23 J27 J28 J30 J31 = LEMO_EPA.00.250: PartField: EPA.00.250.NTN; SolderOption: 0; Pkg: LEMO 5pin; THD Solders: 5; Value: DNP; SMD Solders: 0
P1 = PCI_PMC_TYCO_120521-1: PCI Mezzanine Connector; IEEE 1386; Manufacturer: TE Connectivity; Value: DNP; SMD Solders: 64; THD Solders: 0; Pkg: SMD 64 pin; PartField: TYCO_120521-1
R16 R34-R36 R96 R97#1 R98#1 R103#1 R105 R106#1 R109 R113#1 R114#1 R116 R117#1 R157-R159 R176-R178 = RESC: Resistor, Generic, SMD; Pkg: 0805; Maintainer: Evgeniy Kotov; SMD Solders: 2; THD Solders: 0; Release Date: 06.03.2017; Last Change Data: 09.03.2017
  R16 R103#1 R105 R106#1: PartField: 10MΩ; Value: 10MΩ
  R34-R36 R96 R97#1: PartField: 1kΩ; Value: 1kΩ
  R98#1: PartField: 43kΩ; Value: 43kΩ
  R109 R113#1 R114#1 R116 R117#1 R176-R178: PartField: 5.1kΩ; Value: 5.1kΩ
  R157: PartField: 10kΩ; Value: 10kΩ
  R158 R159: PartField: 51kΩ; Value: 51kΩ
R104#1 R111#1 = RESC: Resistor, Generic, SMD; PartField: 0Ω; Pkg: 0805; Maintainer: Evgeniy Kotov; SMD Solders: 2; THD Solders: 0; Release Date: 06.03.2017; Last Change Data: 09.03.2017; Value: DNP
R110#1 R112 = RESPACK4: Maintainer: Anton Pavlenko; Pkg: SMD 8pin; SMD Solders: 8; THD Solders: 0; PartField: CAY16-4702F4LF; Last Change Data: 16.05.2019; Release Date: 16.05.2019
R135#1 R136 R139 R140 R142 R144 R151 R152 = RESC: Resistor, Generic, SMD; Pkg: 0603; Maintainer: Evgeniy Kotov; SMD Solders: 2; THD Solders: 0; PartField: 100Ω; Release Date: 06.03.2017; Last Change Data: 09.03.2017; Value: 100Ω
TP1-TP14 = TestPoint: Vendor: BINP; SolderOption: 0; Pkg: DNP; PartField: test point; Value: test point; SMD Solders: 0; THD Solders: 0
U26#1 = SN74LVC04APW: Sextuple NOR Gate; Manufacturer: Texas Instruments; INDUSTRY_STD_PKG_TYPE: TSSOP; FAMILY_NAME: NOR_GATE; PIN_COUNT: 14; PACKAGE_DESIGNATOR: PW; Pkg: PW-14; THD Solders: 0; Value: SN74LVC04APW; HelpURL: http://www.ti.com/lit/ds/symlink/sn74lvc04a.pdf; GENERIC_PART_NUMBER: SN74LVC04APW; Vendor: Texas Instruments; Manufacturer_Part_Number: SN74LVC04APW; SMD Solders: 14; PartField: SN74LVC04APW
U27 = TPS3808G33QDBVRQ1: Low-Quiescent-Current Programmable-Delay Supervisory Circuit; Pkg: SOT23-6; SMD Solders: 6; THD Solders: 0; Maintainer: Evgeniy Kotov; Vendor: Texas Instruments; PartField: TPS3808G33QDBVRQ1; ComponentLink1URL: http://www.ti.com/lit/ds/symlink/dac7565.pdf; ComponentLink1Description: Datasheet; Last Change Date: 19.03.2017; Release Date: 19.03.2017; Value: TPS3808G33QDBVRQ1
U30#1 = PCA9544APW: 4-Channel I2C-Bus Multiplexer with Interrupt Logic; Manufacturer: NXP SEMICONDUCTORS; PressFit: No; Bonding: No; Pkg: SSOP20; SMD Solders: 20; THD Solders: 0; Part Number: PCA9544APW; Component Kind: Standard; Component Type: Standard; Device: PCA9544APW; PackageDescription: SOP, 20-Leads, Body 6.6x4.5mm (max), Pitch 0.65mm, IPC Medium Density; Part Description: 4-Channel I2C-Bus Multiplexer with Interrupt Logic; Manufacturer Part Number: PCA9544APW; Pin Count: 20; Case: SSOP20; Mounted: Yes; Socket: No; SMD: Yes; ComponentHeight: 1.1mm; Author: CERN DEM JLC; HelpURL: \\cern.ch\dfs\Applications\Altium\Datasheets\PCA9544APW.pdf; CreateDate: 06/10/2014; LatestRevisionDate: 06/10/2014; Sense: No; Value: PCA9544APW; PartField: PCA9544APW
U31#1 U32-U34 = PCA9534PW: 8-Bit I2C-Bus and SMBus Low Power I/O Port with Interrupt; Manufacturer: ANALOG DEVICES; PressFit: No; Bonding: No; Pkg: SSOP16; SMD Solders: 16; THD Solders: 0; Part Number: PCA9534PW; Component Kind: Standard; Component Type: Standard; Device: PCA9534PW; PackageDescription: SOP, 0.65mm pitch; 16 pin, 4.40mm W X 5.00mm L X 1.10mm H body IPC Medium Density; Part Description: 8-Bit I2C-Bus and SMBus Low Power I/O Port with Interrupt; Manufacturer Part Number: PCA9534PW; Pin Count: 16; Case: SSOP16; Mounted: Yes; Socket: No; SMD: Yes; ComponentHeight: 1.1mm; Author: CERN DEM JLC; HelpURL: \\cern.ch\dfs\Applications\Altium\Datasheets\PCA9534PW.pdf; CreateDate: 18/12/2013; LatestRevisionDate: 18/12/2013; Sense: No; Value: PCA9534PW; PartField: PCA9534PW

## Sheet cyc_v_som_A.SchDoc
size A3
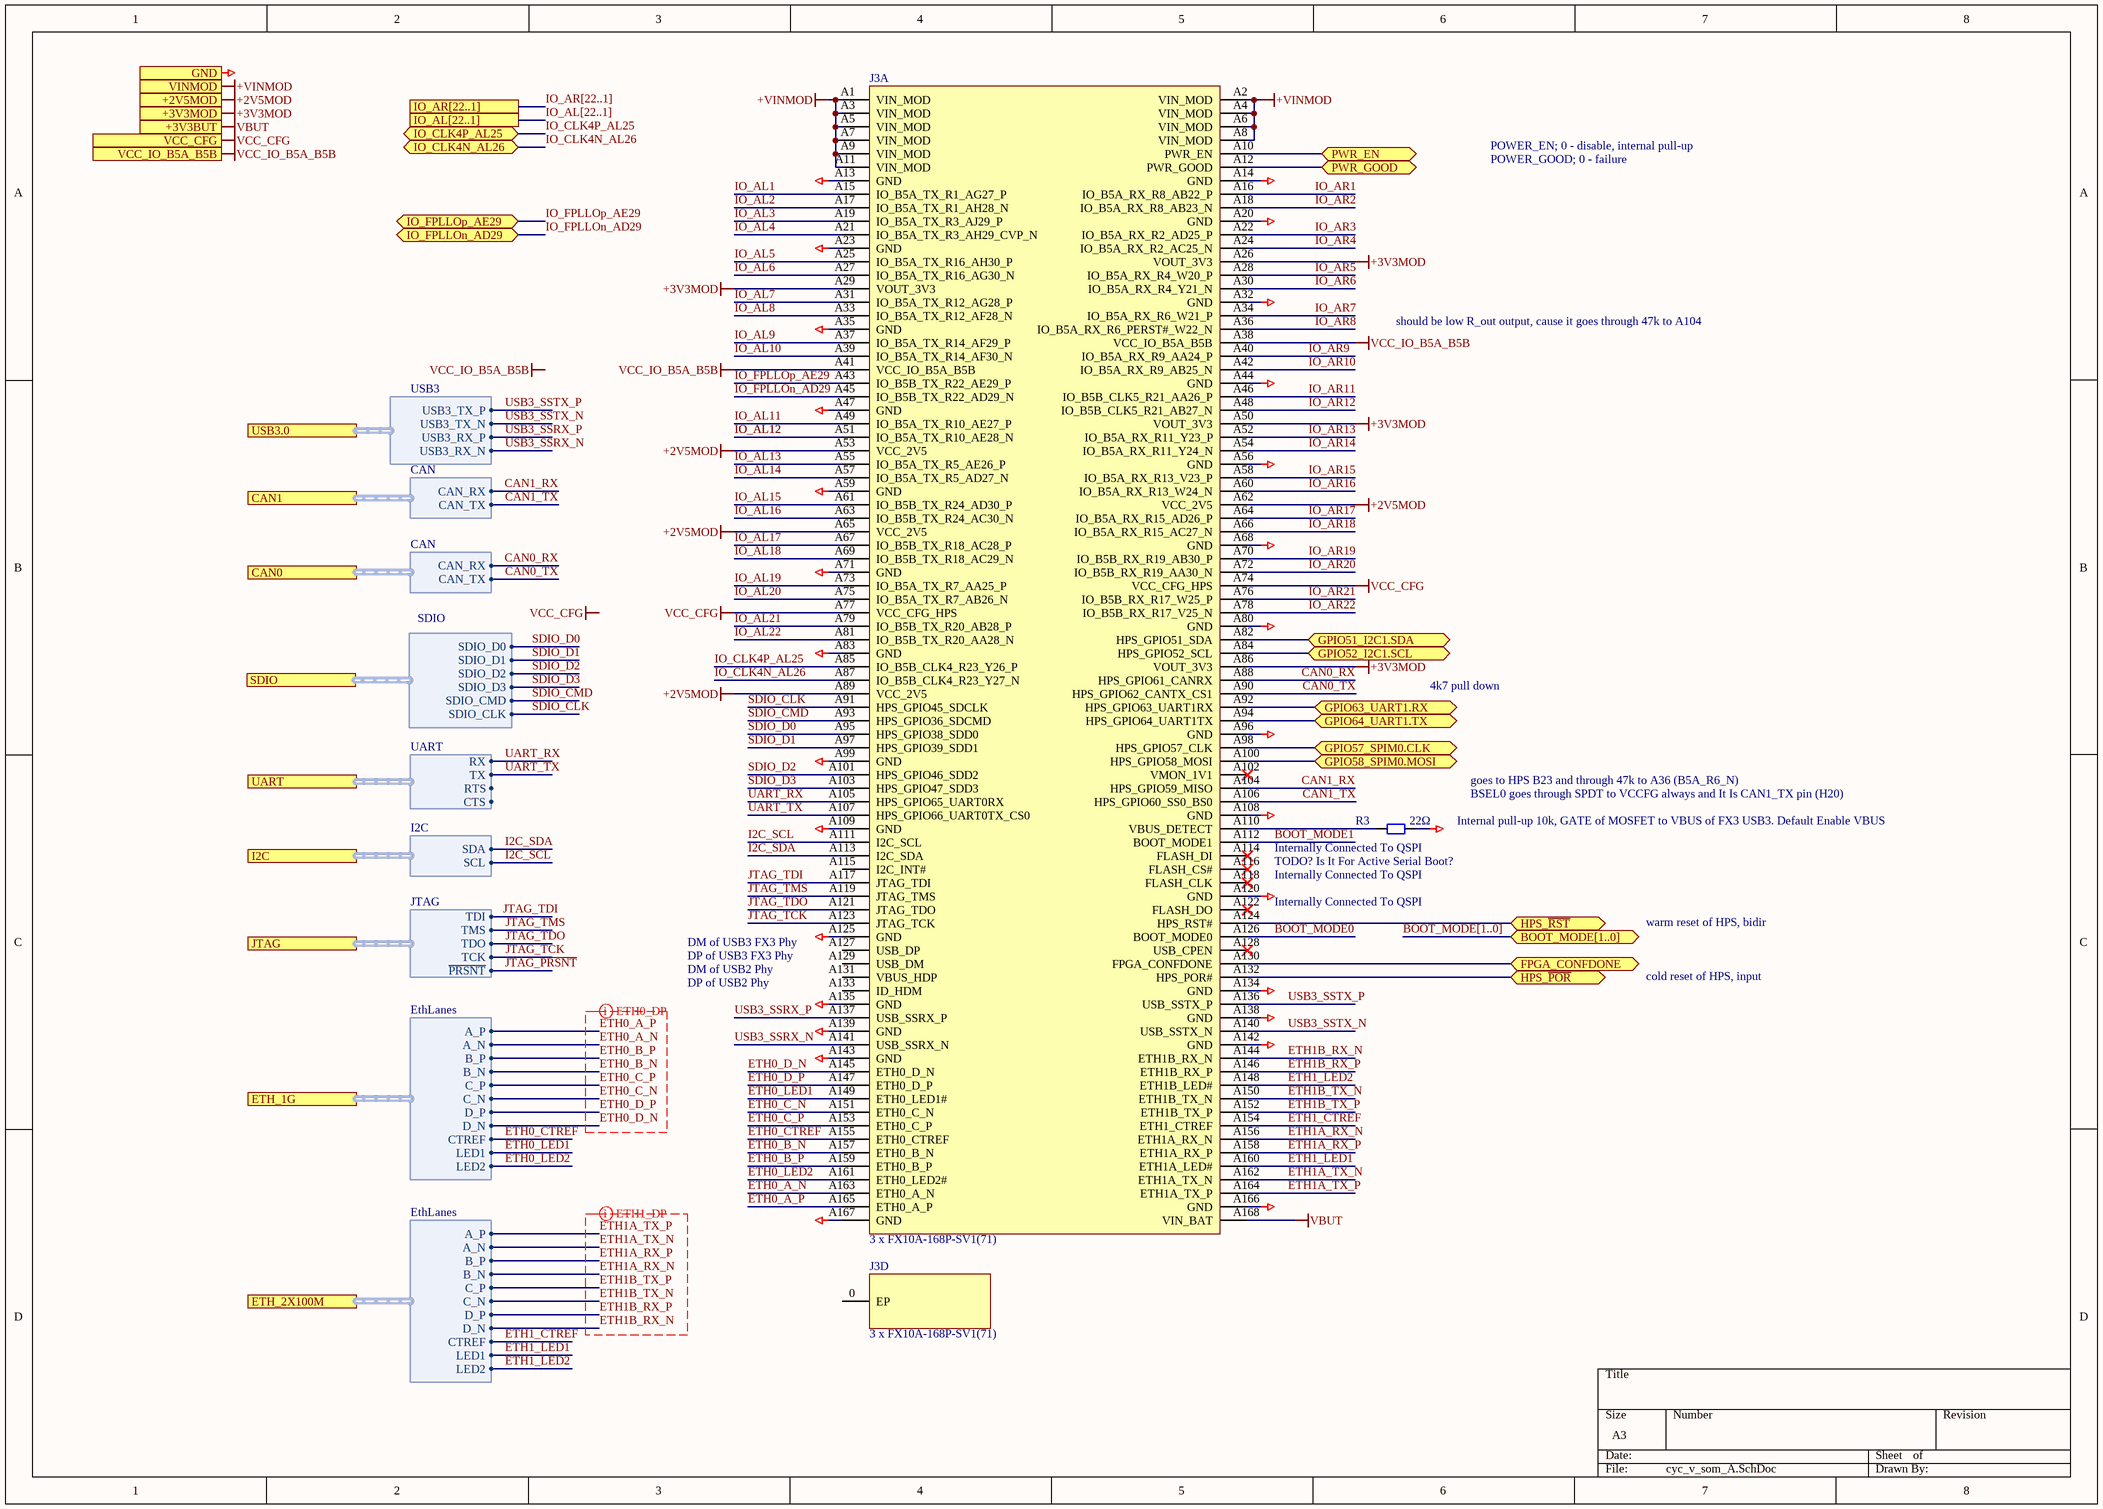
[diagram p1: cyc_v_som_A.SchDoc]

### Parts
J3  3 x FX10A-168P-SV1(71)  [Mercury_SA2p]  (parts A,D of 4)
R3  22Ω  [RESC1608N]

### Ports
+2V5MOD, +3V3BUT, +3V3MOD, BOOT_MODE[1..0] (bidir), CAN0 (harness CAN), CAN1 (harness CAN), ETH_1G (harness EthLanes), ETH_2X100M (harness EthLanes), FPGA_CONFDONE (bidir), GND, GPIO51_I2C1.SDA (bidir), GPIO52_I2C1.SCL (bidir), GPIO57_SPIM0.CLK (bidir), GPIO58_SPIM0.MOSI (bidir), GPIO63_UART1.RX (bidir), GPIO64_UART1.TX (bidir), HPS_~{POR} (bidir), HPS_~{RST} (bidir), I2C (harness I2C), IO_AL[22..1], IO_AR[22..1], IO_CLK4N_AL26 (bidir), IO_CLK4P_AL25 (bidir), IO_FPLLOn_AD29 (bidir), IO_FPLLOp_AE29 (bidir), JTAG (harness JTAG), PWR_EN (bidir), PWR_GOOD (bidir), SDIO (harness SDIO), UART (harness UART), USB3.0 (harness USB3), VCC_CFG, VCC_IO_B5A_B5B, VINMOD

### Harnesses
EthLanes: A_P, A_N, B_P, B_N, C_P, C_N, D_P, D_N, LED1, LED2, CTREF
I2C: SDA, SCL
UART: RX, TX, RTS, CTS
JTAG: TDI, TMS, TDO, TCK, ~{PRSNT}
SDIO: SDIO_D0, SDIO_D1, SDIO_D2, SDIO_D3, SDIO_CMD, SDIO_CLK
CAN: CAN_TX, CAN_RX
USB3: USB3_TX_P, USB3_TX_N, USB3_RX_P, USB3_RX_N

### Nets
+2V5MOD: J3.A53(VCC_2V5) J3.A62(VCC_2V5) J3.A65(VCC_2V5) J3.A89(VCC_2V5) ; port +2V5MOD
+3V3MOD: J3.A26(VOUT_3V3) J3.A29(VOUT_3V3) J3.A50(VOUT_3V3) J3.A86(VOUT_3V3) ; port +3V3MOD
+VINMOD: J3.A1(VIN_MOD) J3.A2(VIN_MOD) J3.A3(VIN_MOD) J3.A4(VIN_MOD) J3.A5(VIN_MOD) J3.A6(VIN_MOD) J3.A7(VIN_MOD) J3.A8(VIN_MOD) J3.A9(VIN_MOD) J3.A11(VIN_MOD) ; port VINMOD  [project net +5VME]
GND: J3.A13(GND) J3.A14(GND) J3.A20(GND) J3.A23(GND) J3.A32(GND) J3.A35(GND) J3.A44(GND) J3.A47(GND) J3.A56(GND) J3.A59(GND) J3.A68(GND) J3.A71(GND) J3.A80(GND) J3.A83(GND) J3.A96(GND) J3.A99(GND) J3.A108(GND) J3.A109(GND) J3.A120(GND) J3.A125(GND) J3.A134(GND) J3.A135(GND) J3.A138(GND) J3.A139(GND) J3.A142(GND) J3.A143(GND) J3.A166(GND) J3.A167(GND) R3.2 ; port GND  [project net POK_int]
VBUT: J3.A168(VIN_BAT) ; port +3V3BUT
VCC_CFG: J3.A38(VCC_IO_B5A_B5B) J3.A41(VCC_IO_B5A_B5B) J3.A74(VCC_CFG_HPS) J3.A77(VCC_CFG_HPS) ; port VCC_CFG, port VCC_IO_B5A_B5B  [also labelled VCC_IO_B5A_B5B]  [project net +3.3VD]
BOOT_MODE0: J3.A126(BOOT_MODE0)
BOOT_MODE1: J3.A112(BOOT_MODE1)
CAN0_RX: J3.A88(HPS_GPIO61_CANRX) ; port CAN0.CAN_RX
CAN0_TX: J3.A90(HPS_GPIO62_CANTX_CS1) ; port CAN0.CAN_TX
CAN1_RX: J3.A104(HPS_GPIO59_MISO) ; port CAN1.CAN_RX
CAN1_TX: J3.A106(HPS_GPIO60_SS0_BS0) ; port CAN1.CAN_TX
ETH0_A_N: J3.A163(ETH0_A_N) ; port ETH_1G.A_N
ETH0_A_P: J3.A165(ETH0_A_P) ; port ETH_1G.A_P
ETH0_B_N: J3.A157(ETH0_B_N) ; port ETH_1G.B_N
ETH0_B_P: J3.A159(ETH0_B_P) ; port ETH_1G.B_P
ETH0_C_N: J3.A151(ETH0_C_N) ; port ETH_1G.C_N
ETH0_C_P: J3.A153(ETH0_C_P) ; port ETH_1G.C_P
ETH0_CTREF: J3.A155(ETH0_CTREF) ; port ETH_1G.CTREF
ETH0_D_N: J3.A145(ETH0_D_N) ; port ETH_1G.D_N
ETH0_D_P: J3.A147(ETH0_D_P) ; port ETH_1G.D_P
ETH0_LED1: J3.A149(ETH0_LED1#) ; port ETH_1G.LED1
ETH0_LED2: J3.A161(ETH0_LED2#) ; port ETH_1G.LED2
ETH1_CTREF: J3.A154(ETH1_CTREF) ; port ETH_2X100M.CTREF
ETH1_LED1: J3.A160(ETH1A_LED#) ; port ETH_2X100M.LED1
ETH1_LED2: J3.A148(ETH1B_LED#) ; port ETH_2X100M.LED2
ETH1A_RX_N: J3.A156(ETH1A_RX_N) ; port ETH_2X100M.B_N
ETH1A_RX_P: J3.A158(ETH1A_RX_P) ; port ETH_2X100M.B_P
ETH1A_TX_N: J3.A162(ETH1A_TX_N) ; port ETH_2X100M.A_N
ETH1A_TX_P: J3.A164(ETH1A_TX_P) ; port ETH_2X100M.A_P
ETH1B_RX_N: J3.A144(ETH1B_RX_N) ; port ETH_2X100M.D_N
ETH1B_RX_P: J3.A146(ETH1B_RX_P) ; port ETH_2X100M.D_P
ETH1B_TX_N: J3.A150(ETH1B_TX_N) ; port ETH_2X100M.C_N
ETH1B_TX_P: J3.A152(ETH1B_TX_P) ; port ETH_2X100M.C_P
FPGA_CONFDONE: J3.A130(FPGA_CONFDONE) ; port FPGA_CONFDONE
GPIO51: J3.A82(HPS_GPIO51_SDA) ; port GPIO51_I2C1.SDA
GPIO52: J3.A84(HPS_GPIO52_SCL) ; port GPIO52_I2C1.SCL
GPIO57: J3.A98(HPS_GPIO57_CLK) ; port GPIO57_SPIM0.CLK
GPIO58: J3.A100(HPS_GPIO58_MOSI) ; port GPIO58_SPIM0.MOSI
GPIO63: J3.A92(HPS_GPIO63_UART1RX) ; port GPIO63_UART1.RX
GPIO64: J3.A94(HPS_GPIO64_UART1TX) ; port GPIO64_UART1.TX
HPS_PORn: J3.A132(HPS_POR#) ; port HPS_~{POR}
HPS_RSTn: J3.A124(HPS_RST#) ; port HPS_~{RST}
I2C_SCL: J3.A111(I2C_SCL) ; port I2C.SCL
I2C_SDA: J3.A113(I2C_SDA) ; port I2C.SDA
IO_AL1: J3.A15(IO_B5A_TX_R1_AG27_P)
IO_AL2: J3.A17(IO_B5A_TX_R1_AH28_N)
IO_AL3: J3.A19(IO_B5A_TX_R3_AJ29_P)
IO_AL4: J3.A21(IO_B5A_TX_R3_AH29_CVP_N)
IO_AL5: J3.A25(IO_B5A_TX_R16_AH30_P)
IO_AL6: J3.A27(IO_B5A_TX_R16_AG30_N)
IO_AL7: J3.A31(IO_B5A_TX_R12_AG28_P)
IO_AL8: J3.A33(IO_B5A_TX_R12_AF28_N)
IO_AL9: J3.A37(IO_B5A_TX_R14_AF29_P)
IO_AL10: J3.A39(IO_B5A_TX_R14_AF30_N)
IO_AL11: J3.A49(IO_B5A_TX_R10_AE27_P)
IO_AL12: J3.A51(IO_B5A_TX_R10_AE28_N)
IO_AL13: J3.A55(IO_B5A_TX_R5_AE26_P)  [project net INT_SFP23]
IO_AL14: J3.A57(IO_B5A_TX_R5_AD27_N)  [project net INT_SFP01]
IO_AL15: J3.A61(IO_B5B_TX_R24_AD30_P)
IO_AL16: J3.A63(IO_B5B_TX_R24_AC30_N)
IO_AL17: J3.A67(IO_B5B_TX_R18_AC28_P)
IO_AL18: J3.A69(IO_B5B_TX_R18_AC29_N)
IO_AL19: J3.A73(IO_B5A_TX_R7_AA25_P)
IO_AL20: J3.A75(IO_B5A_TX_R7_AB26_N)
IO_AL21: J3.A79(IO_B5B_TX_R20_AB28_P)
IO_AL22: J3.A81(IO_B5B_TX_R20_AA28_N)
IO_AR1: J3.A16(IO_B5A_RX_R8_AB22_P)
IO_AR2: J3.A18(IO_B5A_RX_R8_AB23_N)
IO_AR3: J3.A22(IO_B5A_RX_R2_AD25_P)
IO_AR4: J3.A24(IO_B5A_RX_R2_AC25_N)
IO_AR5: J3.A28(IO_B5A_RX_R4_W20_P)
IO_AR6: J3.A30(IO_B5A_RX_R4_Y21_N)
IO_AR7: J3.A34(IO_B5A_RX_R6_W21_P)
IO_AR8: J3.A36(IO_B5A_RX_R6_PERST#_W22_N)
IO_AR9: J3.A40(IO_B5A_RX_R9_AA24_P)
IO_AR10: J3.A42(IO_B5A_RX_R9_AB25_N)
IO_AR11: J3.A46(IO_B5B_CLK5_R21_AA26_P)
IO_AR12: J3.A48(IO_B5B_CLK5_R21_AB27_N)
IO_AR13: J3.A52(IO_B5A_RX_R11_Y23_P)
IO_AR14: J3.A54(IO_B5A_RX_R11_Y24_N)
IO_AR15: J3.A58(IO_B5A_RX_R13_V23_P)
IO_AR16: J3.A60(IO_B5A_RX_R13_W24_N)
IO_AR17: J3.A64(IO_B5A_RX_R15_AD26_P)
IO_AR18: J3.A66(IO_B5A_RX_R15_AC27_N)
IO_AR19: J3.A70(IO_B5B_RX_R19_AB30_P)
IO_AR20: J3.A72(IO_B5B_RX_R19_AA30_N)
IO_AR21: J3.A76(IO_B5B_RX_R17_W25_P)
IO_AR22: J3.A78(IO_B5B_RX_R17_V25_N)
IO_CLK4N_AL26: J3.A87(IO_B5B_CLK4_R23_Y27_N) ; port IO_CLK4N_AL26
IO_CLK4P_AL25: J3.A85(IO_B5B_CLK4_R23_Y26_P) ; port IO_CLK4P_AL25  [project net IO_AL25]
IO_FPLLOn_AD29: J3.A45(IO_B5B_TX_R22_AD29_N) ; port IO_FPLLOn_AD29  [project net QBR_N]
IO_FPLLOp_AE29: J3.A43(IO_B5B_TX_R22_AE29_P) ; port IO_FPLLOp_AE29  [project net QBR_P]
JTAG_TCK: J3.A123(JTAG_TCK) ; port JTAG.TCK
JTAG_TDI: J3.A117(JTAG_TDI) ; port JTAG.TDI
JTAG_TDO: J3.A121(JTAG_TDO) ; port JTAG.TDO
JTAG_TMS: J3.A119(JTAG_TMS) ; port JTAG.TMS
PWR_EN: J3.A10(PWR_EN) ; port PWR_EN
PWR_GOOD: J3.A12(PWR_GOOD) ; port PWR_GOOD
SDIO_CLK: J3.A91(HPS_GPIO45_SDCLK) ; port SDIO.SDIO_CLK
SDIO_CMD: J3.A93(HPS_GPIO36_SDCMD) ; port SDIO.SDIO_CMD
SDIO_D0: J3.A95(HPS_GPIO38_SDD0) ; port SDIO.SDIO_D0
SDIO_D1: J3.A97(HPS_GPIO39_SDD1) ; port SDIO.SDIO_D1
SDIO_D2: J3.A101(HPS_GPIO46_SDD2) ; port SDIO.SDIO_D2
SDIO_D3: J3.A103(HPS_GPIO47_SDD3) ; port SDIO.SDIO_D3
UART_RX: J3.A105(HPS_GPIO65_UART0RX) ; port UART.RX
UART_TX: J3.A107(HPS_GPIO66_UART0TX_CS0) ; port UART.TX
USB3_SSRX_N: J3.A141(USB_SSRX_N) ; port USB3.0.USB3_RX_N
USB3_SSRX_P: J3.A137(USB_SSRX_P) ; port USB3.0.USB3_RX_P
USB3_SSTX_N: J3.A140(USB_SSTX_N) ; port USB3.0.USB3_TX_N
USB3_SSTX_P: J3.A136(USB_SSTX_P) ; port USB3.0.USB3_TX_P
NetJ3_A110: J3.A110(VBUS_DETECT) R3.1

Not connected (* = marked no-connect by the designer): J3 0(EP) A102(VMON_1V1)* A114(FLASH_DI)* A115(I2C_INT#) A116(FLASH_CS#)* A118(FLASH_CLK)* A122(FLASH_DO)* A127(USB_DP) A128(USB_CPEN)* A129(USB_DM) A131(VBUS_HDP) A133(ID_HDM)

### Buses and harness runs
bus BOOT_MODE[1..0] = port BOOT_MODE[1..0]
bus IO_AL[22..1] = port IO_AL[22..1]
bus IO_AR[22..1] = port IO_AR[22..1]

### Layout directives
differential pair; rule Differential Pairs Routing [Pref Gap = 0.175mm    Min Gap  = 0.075mm    Max Gap  = 0.5mmPref Width = 0.25mm    Min Width  = 0.075mm    Max Width  = 0.5mm]: ETH0_A_N, ETH0_A_P, ETH0_B_N, ETH0_B_P, ETH0_C_N, ETH0_C_P, ETH0_D_N, ETH0_D_P, ETH1A_RX_N, ETH1A_RX_P, ETH1A_TX_N, ETH1A_TX_P, ETH1B_RX_N, ETH1B_RX_P, ETH1B_TX_N, ETH1B_TX_P

### Notes on the sheet
- POWER_GOOD; 0 - failure
- POWER_EN; 0 - disable, internal pull-up
- should be low R_out output, cause it goes through 47k to A104
- 4k7 pull down
- goes to HPS B23 and through 47k to A36 (B5A_R6_N)
- (near R3) Internally Connected To QSPI
- (near R3) Internal pull-up 10k, GATE of MOSFET to VBUS of FX3 USB3. Default Enable VBUS
- BSEL0 goes through SPDT to VCCFG always and It Is CAN1_TX pin (H20)
- (near R3) TODO? Is It For Active Serial Boot?
- Internally Connected To QSPI
- DP of USB2 Phy
- DM of USB2 Phy
- DP of USB3 FX3 Phy
- DM of USB3 FX3 Phy
- warm reset of HPS, bidir
- cold reset of HPS, input
- Labels drawn without touching a wire or pin: VCC_CFG, VCC_IO_B5A_B5B

### Library data of the parts
J3 = FX10A-168P-SV_ME-SA2+: Pin_Count: 168; SolderOption: 0; Pkg: SMD 170pin; SMD Solders: 170; HelpURL: https://www.hirose.com/product/document?clcode=CL0570-0044-8-71&productname=FX10A-168P-SV(71)&series=FX10&documenttype=Catalog&lang=ru&documentid=D31650_en; PartField: FX10A-168P-SV1(71); Value: 3 x FX10A-168P-SV1(71); THD Solders: 0
R3 = RESC: as R135#1 on sheet main; PartField: 22Ω; Release Date: 06.03.2017; Last Change Data: 09.03.2017; Value: 22Ω

## Sheet cyc_v_som_B.SchDoc
size A3
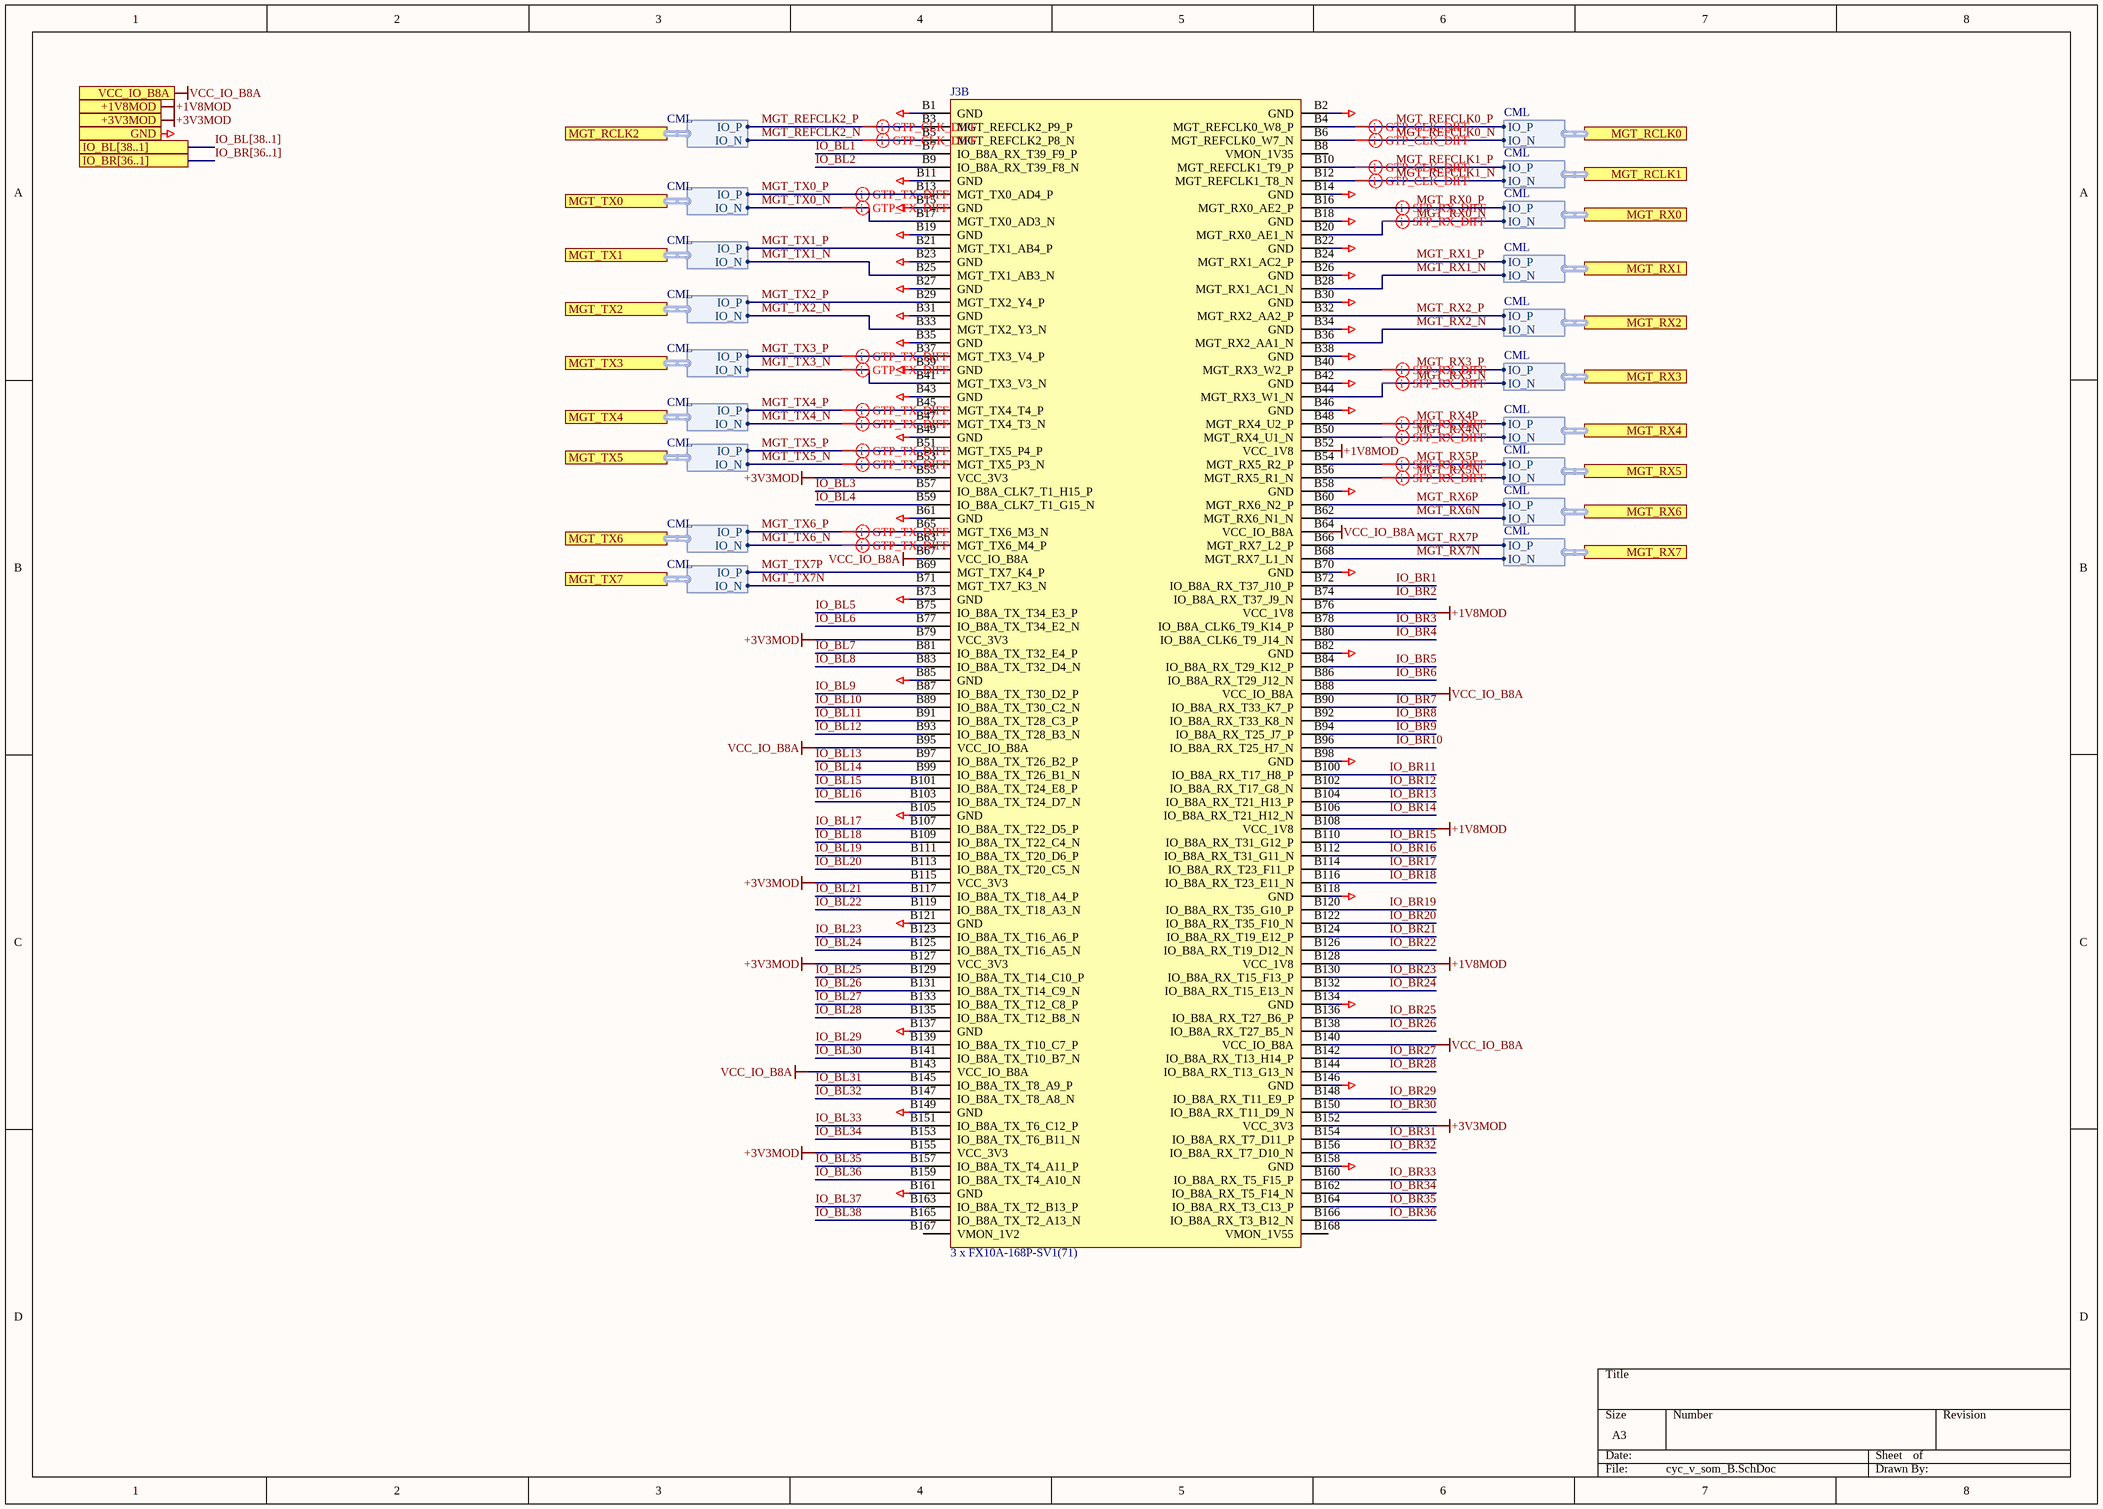
[diagram p2: cyc_v_som_B.SchDoc]

### Parts
J3  3 x FX10A-168P-SV1(71)  [Mercury_SA2p]  (part B of 4)

### Ports
+1V8MOD, +3V3MOD, GND, IO_BL[38..1], IO_BR[36..1], MGT_RCLK0 (harness CML), MGT_RCLK1 (harness CML), MGT_RCLK2 (harness CML), MGT_RX0 (harness CML), MGT_RX1 (harness CML), MGT_RX2 (harness CML), MGT_RX3 (harness CML), MGT_RX4 (harness CML), MGT_RX5 (harness CML), MGT_RX6 (harness CML), MGT_RX7 (harness CML), MGT_TX0 (harness CML), MGT_TX1 (harness CML), MGT_TX2 (harness CML), MGT_TX3 (harness CML), MGT_TX4 (harness CML), MGT_TX5 (harness CML), MGT_TX6 (harness CML), MGT_TX7 (harness CML), VCC_IO_B8A

### Harnesses
CML: IO_N, IO_P

### Nets
+1V8MOD: J3.B52(VCC_1V8) J3.B76(VCC_1V8) J3.B108(VCC_1V8) J3.B128(VCC_1V8) ; port +1V8MOD
+3V3MOD: J3.B55(VCC_3V3) J3.B79(VCC_3V3) J3.B115(VCC_3V3) J3.B127(VCC_3V3) J3.B152(VCC_3V3) J3.B155(VCC_3V3) ; port +3V3MOD
GND: J3.B1(GND) J3.B2(GND) J3.B11(GND) J3.B14(GND) J3.B15(GND) J3.B18(GND) J3.B19(GND) J3.B22(GND) J3.B23(GND) J3.B26(GND) J3.B27(GND) J3.B30(GND) J3.B31(GND) J3.B34(GND) J3.B35(GND) J3.B38(GND) J3.B39(GND) J3.B42(GND) J3.B43(GND) J3.B46(GND) J3.B49(GND) J3.B58(GND) J3.B61(GND) J3.B70(GND) J3.B73(GND) J3.B82(GND) J3.B85(GND) J3.B98(GND) J3.B105(GND) J3.B118(GND) J3.B121(GND) J3.B134(GND) J3.B137(GND) J3.B146(GND) J3.B149(GND) J3.B158(GND) J3.B161(GND) ; port GND  [project net POK_int]
VCC_IO_B8A: J3.B64(VCC_IO_B8A) J3.B67(VCC_IO_B8A) J3.B88(VCC_IO_B8A) J3.B95(VCC_IO_B8A) J3.B140(VCC_IO_B8A) J3.B143(VCC_IO_B8A) ; port VCC_IO_B8A  [project net +2V5MOD]
IO_BL1: J3.B7(IO_B8A_RX_T39_F9_P)
IO_BL2: J3.B9(IO_B8A_RX_T39_F8_N)
IO_BL3: J3.B57(IO_B8A_CLK7_T1_H15_P)
IO_BL4: J3.B59(IO_B8A_CLK7_T1_G15_N)
IO_BL5: J3.B75(IO_B8A_TX_T34_E3_P)
IO_BL6: J3.B77(IO_B8A_TX_T34_E2_N)
IO_BL7: J3.B81(IO_B8A_TX_T32_E4_P)
IO_BL8: J3.B83(IO_B8A_TX_T32_D4_N)
IO_BL9: J3.B87(IO_B8A_TX_T30_D2_P)
IO_BL10: J3.B89(IO_B8A_TX_T30_C2_N)
IO_BL11: J3.B91(IO_B8A_TX_T28_C3_P)
IO_BL12: J3.B93(IO_B8A_TX_T28_B3_N)
IO_BL13: J3.B97(IO_B8A_TX_T26_B2_P)
IO_BL14: J3.B99(IO_B8A_TX_T26_B1_N)
IO_BL15: J3.B101(IO_B8A_TX_T24_E8_P)
IO_BL16: J3.B103(IO_B8A_TX_T24_D7_N)
IO_BL17: J3.B107(IO_B8A_TX_T22_D5_P)
IO_BL18: J3.B109(IO_B8A_TX_T22_C4_N)
IO_BL19: J3.B111(IO_B8A_TX_T20_D6_P)
IO_BL20: J3.B113(IO_B8A_TX_T20_C5_N)
IO_BL21: J3.B117(IO_B8A_TX_T18_A4_P)
IO_BL22: J3.B119(IO_B8A_TX_T18_A3_N)
IO_BL23: J3.B123(IO_B8A_TX_T16_A6_P)
IO_BL24: J3.B125(IO_B8A_TX_T16_A5_N)
IO_BL25: J3.B129(IO_B8A_TX_T14_C10_P)
IO_BL26: J3.B131(IO_B8A_TX_T14_C9_N)
IO_BL27: J3.B133(IO_B8A_TX_T12_C8_P)
IO_BL28: J3.B135(IO_B8A_TX_T12_B8_N)
IO_BL29: J3.B139(IO_B8A_TX_T10_C7_P)
IO_BL30: J3.B141(IO_B8A_TX_T10_B7_N)
IO_BL31: J3.B145(IO_B8A_TX_T8_A9_P)
IO_BL32: J3.B147(IO_B8A_TX_T8_A8_N)
IO_BL33: J3.B151(IO_B8A_TX_T6_C12_P)
IO_BL34: J3.B153(IO_B8A_TX_T6_B11_N)
IO_BL35: J3.B157(IO_B8A_TX_T4_A11_P)
IO_BL36: J3.B159(IO_B8A_TX_T4_A10_N)
IO_BL37: J3.B163(IO_B8A_TX_T2_B13_P)
IO_BL38: J3.B165(IO_B8A_TX_T2_A13_N)
IO_BR1: J3.B72(IO_B8A_RX_T37_J10_P)
IO_BR2: J3.B74(IO_B8A_RX_T37_J9_N)
IO_BR3: J3.B78(IO_B8A_CLK6_T9_K14_P)
IO_BR4: J3.B80(IO_B8A_CLK6_T9_J14_N)
IO_BR5: J3.B84(IO_B8A_RX_T29_K12_P)
IO_BR6: J3.B86(IO_B8A_RX_T29_J12_N)
IO_BR7: J3.B90(IO_B8A_RX_T33_K7_P)
IO_BR8: J3.B92(IO_B8A_RX_T33_K8_N)
IO_BR9: J3.B94(IO_B8A_RX_T25_J7_P)
IO_BR10: J3.B96(IO_B8A_RX_T25_H7_N)
IO_BR11: J3.B100(IO_B8A_RX_T17_H8_P)
IO_BR12: J3.B102(IO_B8A_RX_T17_G8_N)
IO_BR13: J3.B104(IO_B8A_RX_T21_H13_P)
IO_BR14: J3.B106(IO_B8A_RX_T21_H12_N)
IO_BR15: J3.B110(IO_B8A_RX_T31_G12_P)
IO_BR16: J3.B112(IO_B8A_RX_T31_G11_N)
IO_BR17: J3.B114(IO_B8A_RX_T23_F11_P)
IO_BR18: J3.B116(IO_B8A_RX_T23_E11_N)
IO_BR19: J3.B120(IO_B8A_RX_T35_G10_P)
IO_BR20: J3.B122(IO_B8A_RX_T35_F10_N)
IO_BR21: J3.B124(IO_B8A_RX_T19_E12_P)
IO_BR22: J3.B126(IO_B8A_RX_T19_D12_N)
IO_BR23: J3.B130(IO_B8A_RX_T15_F13_P)
IO_BR24: J3.B132(IO_B8A_RX_T15_E13_N)
IO_BR25: J3.B136(IO_B8A_RX_T27_B6_P)
IO_BR26: J3.B138(IO_B8A_RX_T27_B5_N)
IO_BR27: J3.B142(IO_B8A_RX_T13_H14_P)
IO_BR28: J3.B144(IO_B8A_RX_T13_G13_N)
IO_BR29: J3.B148(IO_B8A_RX_T11_E9_P)
IO_BR30: J3.B150(IO_B8A_RX_T11_D9_N)
IO_BR31: J3.B154(IO_B8A_RX_T7_D11_P)
IO_BR32: J3.B156(IO_B8A_RX_T7_D10_N)
IO_BR33: J3.B160(IO_B8A_RX_T5_F15_P)
IO_BR34: J3.B162(IO_B8A_RX_T5_F14_N)
IO_BR35: J3.B164(IO_B8A_RX_T3_C13_P)
IO_BR36: J3.B166(IO_B8A_RX_T3_B12_N)
MGT_REFCLK0_N: J3.B6(MGT_REFCLK0_W7_N) ; port MGT_RCLK0.IO_N  [project net GTP_REF0.IO_N]
MGT_REFCLK0_P: J3.B4(MGT_REFCLK0_W8_P) ; port MGT_RCLK0.IO_P  [project net GTP_REF0.IO_P]
MGT_REFCLK1_N: J3.B12(MGT_REFCLK1_T8_N) ; port MGT_RCLK1.IO_N  [project net GTP_REF1.IO_N]
MGT_REFCLK1_P: J3.B10(MGT_REFCLK1_T9_P) ; port MGT_RCLK1.IO_P  [project net GTP_REF1.IO_P]
MGT_REFCLK2_N: J3.B5(MGT_REFCLK2_P8_N) ; port MGT_RCLK2.IO_N  [project net GTP_REF2.IO_N]
MGT_REFCLK2_P: J3.B3(MGT_REFCLK2_P9_P) ; port MGT_RCLK2.IO_P  [project net GTP_REF2.IO_P]
MGT_RX0_N: J3.B20(MGT_RX0_AE1_N) ; port MGT_RX0.IO_N  [project net SFP_RX_0.IO_N]
MGT_RX0_P: J3.B16(MGT_RX0_AE2_P) ; port MGT_RX0.IO_P  [project net SFP_RX_0.IO_P]
MGT_RX1_N: J3.B28(MGT_RX1_AC1_N) ; port MGT_RX1.IO_N
MGT_RX1_P: J3.B24(MGT_RX1_AC2_P) ; port MGT_RX1.IO_P
MGT_RX2_N: J3.B36(MGT_RX2_AA1_N) ; port MGT_RX2.IO_N
MGT_RX2_P: J3.B32(MGT_RX2_AA2_P) ; port MGT_RX2.IO_P
MGT_RX3_N: J3.B44(MGT_RX3_W1_N) ; port MGT_RX3.IO_N  [project net SFP_RX_1.IO_N]
MGT_RX3_P: J3.B40(MGT_RX3_W2_P) ; port MGT_RX3.IO_P  [project net SFP_RX_1.IO_P]
MGT_RX4N: J3.B50(MGT_RX4_U1_N) ; port MGT_RX4.IO_N  [project net SFP_RX_2.IO_N]
MGT_RX4P: J3.B48(MGT_RX4_U2_P) ; port MGT_RX4.IO_P  [project net SFP_RX_2.IO_P]
MGT_RX5N: J3.B56(MGT_RX5_R1_N) ; port MGT_RX5.IO_N  [project net SFP_RX_3.IO_N]
MGT_RX5P: J3.B54(MGT_RX5_R2_P) ; port MGT_RX5.IO_P  [project net SFP_RX_3.IO_P]
MGT_RX6N: J3.B62(MGT_RX6_N1_N) ; port MGT_RX6.IO_N
MGT_RX6P: J3.B60(MGT_RX6_N2_P) ; port MGT_RX6.IO_P
MGT_RX7N: J3.B68(MGT_RX7_L1_N) ; port MGT_RX7.IO_N
MGT_RX7P: J3.B66(MGT_RX7_L2_P) ; port MGT_RX7.IO_P
MGT_TX0_N: J3.B17(MGT_TX0_AD3_N) ; port MGT_TX0.IO_N  [project net SFP_TX_0.IO_N]
MGT_TX0_P: J3.B13(MGT_TX0_AD4_P) ; port MGT_TX0.IO_P  [project net SFP_TX_0.IO_P]
MGT_TX1_N: J3.B25(MGT_TX1_AB3_N) ; port MGT_TX1.IO_N
MGT_TX1_P: J3.B21(MGT_TX1_AB4_P) ; port MGT_TX1.IO_P
MGT_TX2_N: J3.B33(MGT_TX2_Y3_N) ; port MGT_TX2.IO_N
MGT_TX2_P: J3.B29(MGT_TX2_Y4_P) ; port MGT_TX2.IO_P
MGT_TX3_N: J3.B41(MGT_TX3_V3_N) ; port MGT_TX3.IO_N  [project net SFP_TX_1.IO_N]
MGT_TX3_P: J3.B37(MGT_TX3_V4_P) ; port MGT_TX3.IO_P  [project net SFP_TX_1.IO_P]
MGT_TX4_N: J3.B47(MGT_TX4_T3_N) ; port MGT_TX4.IO_N  [project net SFP_TX_2.IO_N]
MGT_TX4_P: J3.B45(MGT_TX4_T4_P) ; port MGT_TX4.IO_P  [project net SFP_TX_2.IO_P]
MGT_TX5_N: J3.B53(MGT_TX5_P3_N) ; port MGT_TX5.IO_N  [project net SFP_TX_3.IO_N]
MGT_TX5_P: J3.B51(MGT_TX5_P4_P) ; port MGT_TX5.IO_P  [project net SFP_TX_3.IO_P]
MGT_TX6_N: J3.B63(MGT_TX6_M4_P) ; port MGT_TX6.IO_N
MGT_TX6_P: J3.B65(MGT_TX6_M3_N) ; port MGT_TX6.IO_P
MGT_TX7N: J3.B71(MGT_TX7_K3_N) ; port MGT_TX7.IO_N
MGT_TX7P: J3.B69(MGT_TX7_K4_P) ; port MGT_TX7.IO_P

Not connected (* = marked no-connect by the designer): J3 B8(VMON_1V35) B167(VMON_1V2) B168(VMON_1V55)

### Buses and harness runs
bus IO_BL[38..1] = port IO_BL[38..1]
bus IO_BR[36..1] = port IO_BR[36..1]

### Layout directives
differential pair; rule Differential Pairs Routing [Pref Gap = 0.175mm    Min Gap  = 0.075mm    Max Gap  = 0.5mmPref Width = 0.25mm    Min Width  = 0.075mm    Max Width  = 0.5mm]: GTP_REF0.IO_N, GTP_REF0.IO_P, GTP_REF1.IO_N, GTP_REF1.IO_P, GTP_REF2.IO_N, GTP_REF2.IO_P, MGT_TX6_N, MGT_TX6_P, SFP_RX_0.IO_N, SFP_RX_0.IO_P, SFP_RX_1.IO_N, SFP_RX_1.IO_P, SFP_RX_2.IO_N, SFP_RX_2.IO_P, SFP_RX_3.IO_N, SFP_RX_3.IO_P, SFP_TX_0.IO_N, SFP_TX_0.IO_P, SFP_TX_1.IO_N, SFP_TX_1.IO_P, SFP_TX_2.IO_N, SFP_TX_2.IO_P, SFP_TX_3.IO_N, SFP_TX_3.IO_P

### Library data of the parts
J3 = FX10A-168P-SV_ME-SA2+: as J3 on sheet cyc_v_som_A; HelpURL: https://www.hirose.com/product/document?clcode=CL0570-0044-8-71&productname=FX10A-168P-SV(71)&series=FX10&documenttype=Catalog&lang=ru&documentid=D31650_en; PartField: FX10A-168P-SV1(71); Value: 3 x FX10A-168P-SV1(71); THD Solders: 0